# EAGLE design spectral_analyzer (EAGLE 5.06)
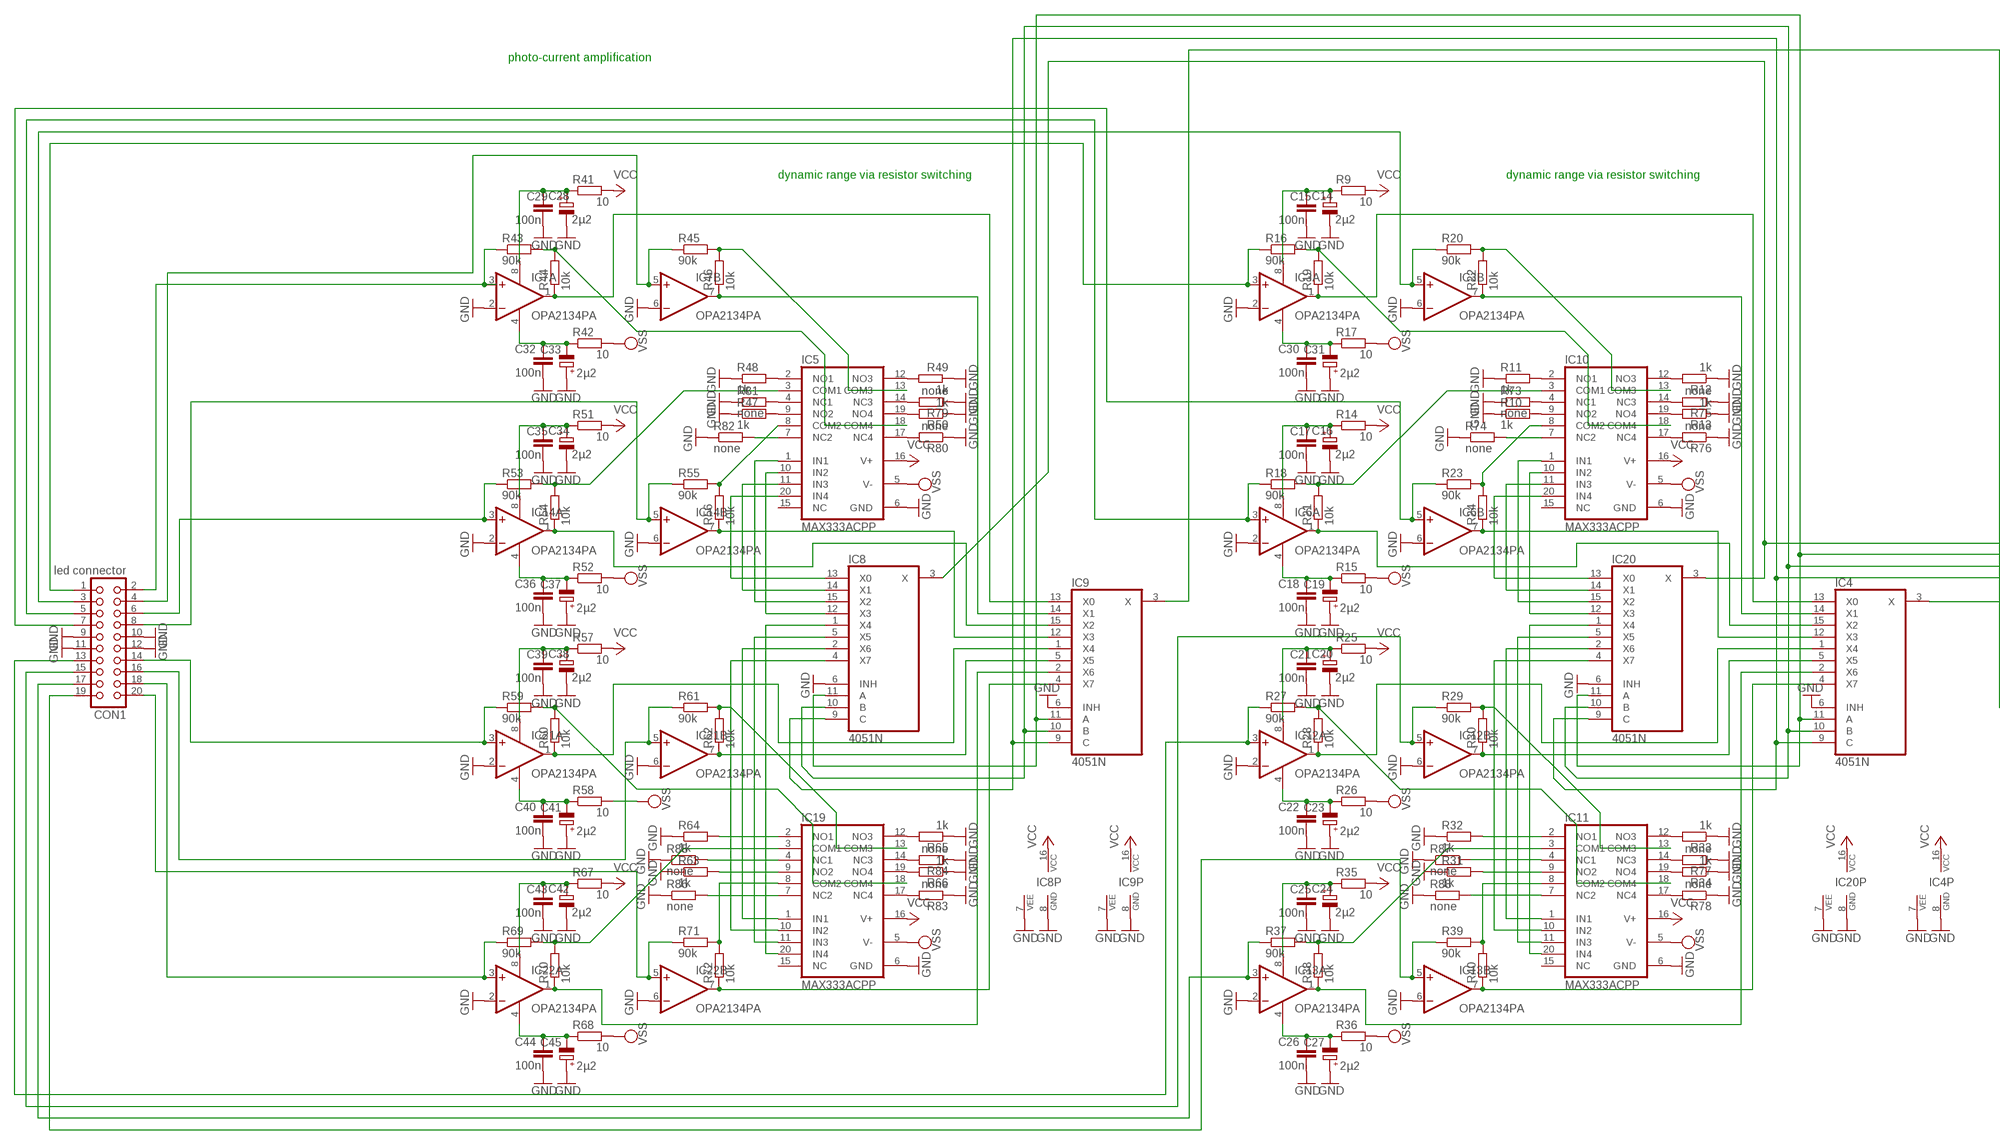
[diagram p0: schematic, sheet 1, part 1 of 2]
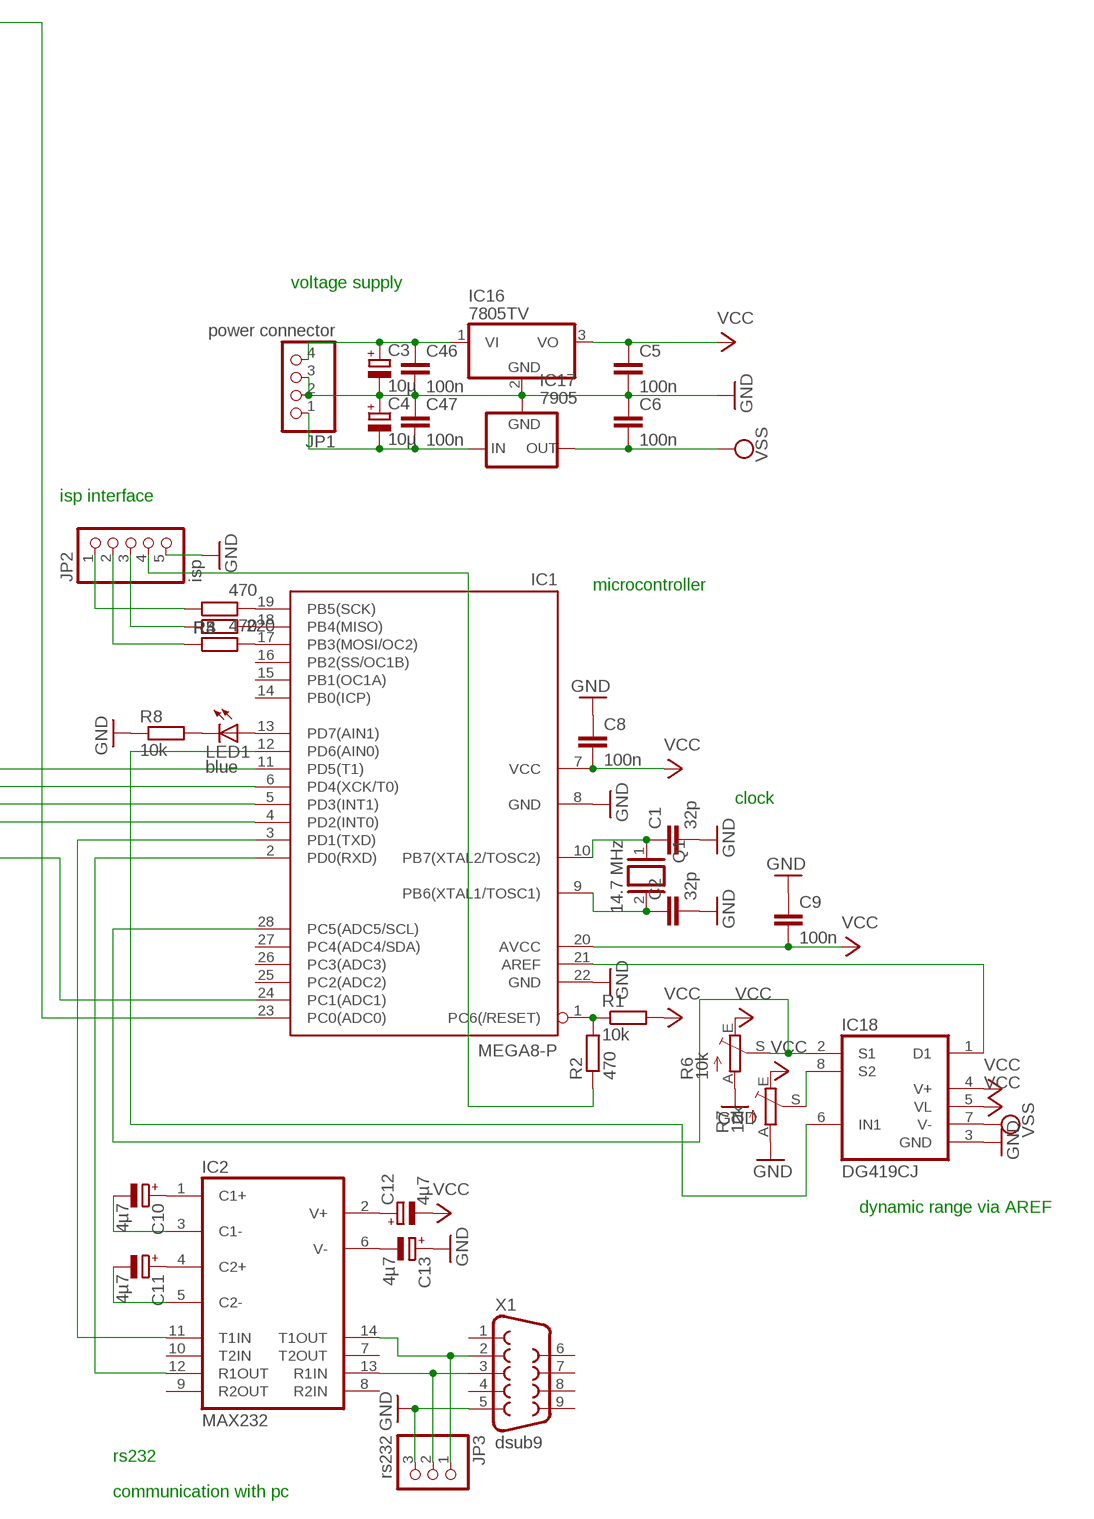
[diagram p1: schematic, sheet 1, part 2 of 2]

## Parts
C1  32p  C-EU025-025X050  [C025-025X050]
C2  32p  C-EU025-025X050  [C025-025X050]
C3  10µ  CPOL-EUE2,5-6E  [E2,5-6E]
C4  10µ  CPOL-EUE2,5-6E  [E2,5-6E]
C5  100n  C-EU025-025X050  [C025-025X050]
C6  100n  C-EU025-025X050  [C025-025X050]
C8  100n  C-EU025-025X050  [C025-025X050]
C9  100n  C-EU025-025X050  [C025-025X050]
C10  4µ7  CPOL-EUE2,5-6E  [E2,5-6E]
C11  4µ7  CPOL-EUE2,5-6E  [E2,5-6E]
C12  4µ7  CPOL-EUE2,5-6E  [E2,5-6E]
C13  4µ7  CPOL-EUE2,5-6E  [E2,5-6E]
C14  2µ2  CPOL-EUE2,5-6E  [E2,5-6E]
C15  100n  C-EU025-025X050  [C025-025X050]
C16  2µ2  CPOL-EUE2,5-6E  [E2,5-6E]
C17  100n  C-EU025-025X050  [C025-025X050]
C18  100n  C-EU025-025X050  [C025-025X050]
C19  2µ2  CPOL-EUE2,5-6E  [E2,5-6E]
C20  2µ2  CPOL-EUE2,5-6E  [E2,5-6E]
C21  100n  C-EU025-025X050  [C025-025X050]
C22  100n  C-EU025-025X050  [C025-025X050]
C23  2µ2  CPOL-EUE2,5-6E  [E2,5-6E]
C24  2µ2  CPOL-EUE2,5-6E  [E2,5-6E]
C25  100n  C-EU025-025X050  [C025-025X050]
C26  100n  C-EU025-025X050  [C025-025X050]
C27  2µ2  CPOL-EUE2,5-6E  [E2,5-6E]
C28  2µ2  CPOL-EUE2,5-6E  [E2,5-6E]
C29  100n  C-EU025-025X050  [C025-025X050]
C30  100n  C-EU025-025X050  [C025-025X050]
C31  2µ2  CPOL-EUE2,5-6E  [E2,5-6E]
C32  100n  C-EU025-025X050  [C025-025X050]
C33  2µ2  CPOL-EUE2,5-6E  [E2,5-6E]
C34  2µ2  CPOL-EUE2,5-6E  [E2,5-6E]
C35  100n  C-EU025-025X050  [C025-025X050]
C36  100n  C-EU025-025X050  [C025-025X050]
C37  2µ2  CPOL-EUE2,5-6E  [E2,5-6E]
C38  2µ2  CPOL-EUE2,5-6E  [E2,5-6E]
C39  100n  C-EU025-025X050  [C025-025X050]
C40  100n  C-EU025-025X050  [C025-025X050]
C41  2µ2  CPOL-EUE2,5-6E  [E2,5-6E]
C42  2µ2  CPOL-EUE2,5-6E  [E2,5-6E]
C43  100n  C-EU025-025X050  [C025-025X050]
C44  100n  C-EU025-025X050  [C025-025X050]
C45  2µ2  CPOL-EUE2,5-6E  [E2,5-6E]
C46  100n  C-EU025-025X050  [C025-025X050]
C47  100n  C-EU025-025X050  [C025-025X050]
CON1  led connector  CON20  [CON20]
IC1  MEGA8-P  [DIL28-3]
IC2  MAX232  [DIL16]
IC3  OPA2134PA  [DIL08]
IC4  4051N  [DIL16]
IC5  MAX333ACPP  [DIL20]
IC6  OPA2134PA  [DIL08]
IC7  OPA2134PA  [DIL08]
IC8  4051N  [DIL16]
IC9  4051N  [DIL16]
IC10  MAX333ACPP  [DIL20]
IC11  MAX333ACPP  [DIL20]
IC12  OPA2134PA  [DIL08]
IC13  OPA2134PA  [DIL08]
IC14  OPA2134PA  [DIL08]
IC16  7805TV  [TO220V]
IC17  7905  79XXS  [79XXS]
IC18  DG419CJ  [DIL08]
IC19  MAX333ACPP  [DIL20]
IC20  4051N  [DIL16]
IC21  OPA2134PA  [DIL08]
IC22  OPA2134PA  [DIL08]
JP1  power connector  PINHD-1X4  [1X04]
JP2  isp  PINHD-1X5  [1X05]
JP3  rs232  PINHD-1X3  [1X03]
LED1  blue  LED3MM  [LED3MM]
Q1  14.7 MHz  XTAL/S  [QS]
R1  10k  R-EU_0207/2V  [0207/2V]
R2  470  R-EU_0207/2V  [0207/2V]
R3  470  R-EU_0207/2V  [0207/2V]
R4  220  R-EU_0207/2V  [0207/2V]
R5  470  R-EU_0207/2V  [0207/2V]
R6  10k  TRIM_EU-ST10  [ST10]
R7  10k  TRIM_EU-ST10  [ST10]
R8  10k  R-EU_0207/2V  [0207/2V]
R9  10  R-EU_0207/2V  [0207/2V]
R10  1k  R-EU_0207/2V  [0207/2V]
R11  1k  R-EU_0207/2V  [0207/2V]
R12  1k  R-EU_0207/2V  [0207/2V]
R13  1k  R-EU_0207/2V  [0207/2V]
R14  10  R-EU_0207/2V  [0207/2V]
R15  10  R-EU_0207/2V  [0207/2V]
R16  90k  R-EU_0207/2V  [0207/2V]
R17  10  R-EU_0207/2V  [0207/2V]
R18  90k  R-EU_0207/2V  [0207/2V]
R19  10k  R-EU_0207/2V  [0207/2V]
R20  90k  R-EU_0207/2V  [0207/2V]
R21  10k  R-EU_0207/2V  [0207/2V]
R22  10k  R-EU_0207/2V  [0207/2V]
R23  90k  R-EU_0207/2V  [0207/2V]
R24  10k  R-EU_0207/2V  [0207/2V]
R25  10  R-EU_0207/2V  [0207/2V]
R26  10  R-EU_0207/2V  [0207/2V]
R27  90k  R-EU_0207/2V  [0207/2V]
R28  10k  R-EU_0207/2V  [0207/2V]
R29  90k  R-EU_0207/2V  [0207/2V]
R30  10k  R-EU_0207/2V  [0207/2V]
R31  1k  R-EU_0207/2V  [0207/2V]
R32  1k  R-EU_0207/2V  [0207/2V]
R33  1k  R-EU_0207/2V  [0207/2V]
R34  1k  R-EU_0207/2V  [0207/2V]
R35  10  R-EU_0207/2V  [0207/2V]
R36  10  R-EU_0207/2V  [0207/2V]
R37  90k  R-EU_0207/2V  [0207/2V]
R38  10k  R-EU_0207/2V  [0207/2V]
R39  90k  R-EU_0207/2V  [0207/2V]
R40  10k  R-EU_0207/2V  [0207/2V]
R41  10  R-EU_0207/2V  [0207/2V]
R42  10  R-EU_0207/2V  [0207/2V]
R43  90k  R-EU_0207/2V  [0207/2V]
R44  10k  R-EU_0207/2V  [0207/2V]
R45  90k  R-EU_0207/2V  [0207/2V]
R46  10k  R-EU_0207/2V  [0207/2V]
R47  1k  R-EU_0207/2V  [0207/2V]
R48  1k  R-EU_0207/2V  [0207/2V]
R49  1k  R-EU_0207/2V  [0207/2V]
R50  1k  R-EU_0207/2V  [0207/2V]
R51  10  R-EU_0207/2V  [0207/2V]
R52  10  R-EU_0207/2V  [0207/2V]
R53  90k  R-EU_0207/2V  [0207/2V]
R54  10k  R-EU_0207/2V  [0207/2V]
R55  90k  R-EU_0207/2V  [0207/2V]
R56  10k  R-EU_0207/2V  [0207/2V]
R57  10  R-EU_0207/2V  [0207/2V]
R58  10  R-EU_0207/2V  [0207/2V]
R59  90k  R-EU_0207/2V  [0207/2V]
R60  10k  R-EU_0207/2V  [0207/2V]
R61  90k  R-EU_0207/2V  [0207/2V]
R62  10k  R-EU_0207/2V  [0207/2V]
R63  1k  R-EU_0207/2V  [0207/2V]
R64  1k  R-EU_0207/2V  [0207/2V]
R65  1k  R-EU_0207/2V  [0207/2V]
R66  1k  R-EU_0207/2V  [0207/2V]
R67  10  R-EU_0207/2V  [0207/2V]
R68  10  R-EU_0207/2V  [0207/2V]
R69  90k  R-EU_0207/2V  [0207/2V]
R70  10k  R-EU_0207/2V  [0207/2V]
R71  90k  R-EU_0207/2V  [0207/2V]
R72  10k  R-EU_0207/2V  [0207/2V]
R73  none  R-EU_0207/2V  [0207/2V]
R74  none  R-EU_0207/2V  [0207/2V]
R75  none  R-EU_0207/2V  [0207/2V]
R76  none  R-EU_0207/2V  [0207/2V]
R77  none  R-EU_0207/2V  [0207/2V]
R78  none  R-EU_0207/2V  [0207/2V]
R79  none  R-EU_0207/2V  [0207/2V]
R80  none  R-EU_0207/2V  [0207/2V]
R81  none  R-EU_0207/2V  [0207/2V]
R82  none  R-EU_0207/2V  [0207/2V]
R83  none  R-EU_0207/2V  [0207/2V]
R84  none  R-EU_0207/2V  [0207/2V]
R85  none  R-EU_0207/2V  [0207/2V]
R86  none  R-EU_0207/2V  [0207/2V]
R87  none  R-EU_0207/2V  [0207/2V]
R88  none  R-EU_0207/2V  [0207/2V]
X1  dsub9  F09HP  [F09HP]

## Nets
GND: C1.2 C2.2 C3.- C4.+ C5.2 C6.1 C8.1 C9.1 C13.+ C14.- C15.2 C16.- C17.2 C18.2 C19.+ C20.- C21.2 C22.2 C23.+ C24.- C25.2 C26.2 C27.+ C28.- C29.2 C30.2 C31.+ C32.2 C33.+ C34.- C35.2 C36.2 C37.+ C38.- C39.2 C40.2 C41.+ C42.- C43.2 C44.2 C45.+ C46.2 C47.1 CON1.9 CON1.10 CON1.11 CON1.12 IC1.8(GND) IC1.22(GND) IC3.2(A:-IN) IC3.6(B:-IN) IC4.6(INH) IC4.7(VEE) IC4.8(GND) IC5.6(GND) IC6.2(A:-IN) IC6.6(B:-IN) IC7.2(A:-IN) IC7.6(B:-IN) IC8.6(INH) IC8.7(VEE) IC8.8(GND) IC9.6(INH) IC9.7(VEE) IC9.8(GND) IC10.6(GND) IC11.6(GND) IC12.2(A:-IN) IC12.6(B:-IN) IC13.2(A:-IN) IC13.6(B:-IN) IC14.2(A:-IN) IC14.6(B:-IN) IC16.2(GND) IC17.GND IC18.3(GND) IC19.6(GND) IC20.6(INH) IC20.7(VEE) IC20.8(GND) IC21.2(A:-IN) IC21.6(B:-IN) IC22.2(A:-IN) IC22.6(B:-IN) JP1.2 JP1.3 JP2.5 JP3.3 R6.A R7.A R8.1 R10.1 R11.1 R12.1 R13.1 R31.1 R32.1 R33.1 R34.1 R47.1 R48.1 R49.1 R50.1 R63.1 R64.1 R65.1 R66.1 R73.1 R74.1 R75.1 R76.1 R77.1 R78.1 R79.1 R80.1 R81.1 R82.1 R83.1 R84.1 R85.1 R86.1 R87.1 R88.1 X1.5
N$1: C1.1 IC1.10(PB7(XTAL2/TOSC2)) Q1.1
N$2: C2.1 IC1.9(PB6(XTAL1/TOSC1)) Q1.2
N$3: C4.- C47.2 IC17.IN JP1.1
N$4: C3.+ C46.1 IC16.1(VI) JP1.4
N$5: IC1.1(PC6(/RESET)) R1.1 R2.2
N$6: IC1.21(AREF) IC18.1(D1)
N$7: IC1.17(PB3(MOSI/OC2)) R3.2
N$8: IC1.18(PB4(MISO)) R4.2
N$9: IC1.19(PB5(SCK)) R5.2
N$10: IC18.8(S2) R7.S
N$11: JP2.4 R2.1
N$12: JP2.1 R5.1
N$13: JP2.2 R3.1
N$14: JP2.3 R4.1
N$15: IC1.28(PC5(ADC5/SCL)) IC18.2(S1) R6.S
N$16: LED1.K(C) R8.2
N$17: IC1.13(PD7(AIN1)) LED1.A
N$18: C10.+ IC2.1(C1+)
N$19: C11.+ IC2.4(C2+)
N$20: C12.+ IC2.2(V+)
N$21: C13.- IC2.6(V-)
N$22: C10.- IC2.3(C1-)
N$23: C11.- IC2.5(C2-)
N$24: IC2.13(R1IN) JP3.2 X1.3
N$25: IC2.14(T1OUT) JP3.1 X1.2
N$26: C14.+ C15.1 IC3.8(A:V+) R9.1
N$27: IC1.3(PD1(TXD)) IC2.11(T1IN)
N$28: IC19.8(COM2) R71.2 R72.2
N$29: IC3.7(B:OUT) IC4.14(X1) R22.1
N$30: IC10.9(NO2) R10.2
N$31: IC10.2(NO1) R11.2
N$32: IC10.12(NO3) R12.2
N$33: IC10.19(NO4) R13.2
N$34: C16.+ C17.1 IC6.8(A:V+) R14.1
N$35: CON1.1 IC3.3(A:+IN) R16.1
N$36: C30.1 C31.- IC3.4(A:V-) R17.1
N$37: C20.+ C21.1 IC12.8(A:V+) R25.1
N$38: IC3.1(A:OUT) IC4.13(X0) R19.1
N$39: C22.1 C23.- IC12.4(A:V-) R26.1
N$40: C18.1 C19.- IC6.4(A:V-) R15.1
N$41: CON1.3 IC3.5(B:+IN) R20.1
N$42: CON1.5 IC6.3(A:+IN) R18.1
N$43: IC10.3(COM1) R18.2 R21.2
N$44: IC4.1(X4) IC12.1(A:OUT) R28.1
N$45: IC10.8(COM2) R23.2 R24.2
N$46: CON1.7 IC6.5(B:+IN) R23.1
N$47: IC4.12(X3) IC6.7(B:OUT) R24.1
N$48: IC11.20(IN4) IC20.1(X4)
N$49: CON1.13 IC12.3(A:+IN) R27.1
N$50: IC10.13(COM3) R20.2 R22.2
N$51: IC10.20(IN4) IC20.13(X0)
N$52: CON1.15 IC12.5(B:+IN) R29.1
N$53: IC4.5(X5) IC12.7(B:OUT) R30.1
N$54: IC11.9(NO2) R31.2
N$55: IC11.2(NO1) R32.2
N$56: IC11.12(NO3) R33.2
N$57: IC11.19(NO4) R34.2
N$58: C24.+ C25.1 IC13.8(A:V+) R35.1
N$59: C26.1 C27.- IC13.4(A:V-) R36.1
N$60: CON1.17 IC13.3(A:+IN) R37.1
N$61: IC11.3(COM1) R37.2 R38.2
N$62: IC4.2(X6) IC13.1(A:OUT) R38.1
N$63: CON1.2 IC7.3(A:+IN) R43.1
N$64: CON1.19 IC13.5(B:+IN) R39.1
N$65: IC4.4(X7) IC13.7(B:OUT) R40.1
N$66: IC11.13(COM3) R29.2 R30.2
N$67: IC11.11(IN3) IC20.5(X5)
N$68: IC4.15(X2) IC6.1(A:OUT) R21.1
N$69: IC10.11(IN3) IC20.14(X1)
N$70: IC10.1(IN1) IC20.15(X2)
N$71: IC10.10(IN2) IC20.12(X3)
N$72: IC11.1(IN1) IC20.2(X6)
N$73: C28.+ C29.1 IC7.8(A:V+) R41.1
N$74: IC10.18(COM4) R16.2 R19.2
N$75: IC11.10(IN2) IC20.4(X7)
N$76: IC1.24(PC1(ADC1)) IC4.3(X)
N$77: IC11.18(COM4) R27.2 R28.2
N$78: IC1.23(PC0(ADC0)) IC9.3(X)
N$79: IC1.11(PD5(T1)) IC8.3(X) IC20.3(X)
N$80: C32.1 C33.- IC7.4(A:V-) R42.1
N$81: IC19.12(NO3) R65.2
N$82: IC7.1(A:OUT) IC9.13(X0) R44.1
N$83: CON1.4 IC7.5(B:+IN) R45.1
N$84: IC7.7(B:OUT) IC9.14(X1) R46.1
N$85: IC5.9(NO2) R47.2
N$86: IC5.2(NO1) R48.2
N$87: IC5.12(NO3) R49.2
N$88: IC5.19(NO4) R50.2
N$89: C34.+ C35.1 IC14.8(A:V+) R51.1
N$90: C36.1 C37.- IC14.4(A:V-) R52.1
N$91: CON1.6 IC14.3(A:+IN) R53.1
N$92: IC5.3(COM1) R53.2 R54.2
N$93: IC5.8(COM2) R55.2 R56.2
N$94: CON1.8 IC14.5(B:+IN) R55.1
N$95: IC9.12(X3) IC14.7(B:OUT) R56.1
N$96: IC5.13(COM3) R45.2 R46.2
N$97: C38.+ C39.1 IC21.8(A:V+) R57.1
N$98: C40.1 C41.- IC21.4(A:V-) R58.1
N$99: CON1.14 IC21.3(A:+IN) R59.1
N$100: CON1.16 IC21.5(B:+IN) R61.1
N$101: IC9.5(X5) IC21.7(B:OUT) R62.1
N$102: IC19.9(NO2) R63.2
N$103: IC19.2(NO1) R64.2
N$104: IC19.19(NO4) R66.2
N$105: IC19.17(NC4) R83.2
N$106: C42.+ C43.1 IC22.8(A:V+) R67.1
N$107: C44.1 C45.- IC22.4(A:V-) R68.1
N$108: CON1.18 IC22.3(A:+IN) R69.1
N$109: IC19.3(COM1) R69.2 R70.2
N$110: IC9.2(X6) IC22.1(A:OUT) R70.1
N$111: IC11.8(COM2) R39.2 R40.2
N$112: CON1.20 IC22.5(B:+IN) R71.1
N$113: IC9.4(X7) IC22.7(B:OUT) R72.1
N$114: IC19.13(COM3) R61.2 R62.2
N$115: IC9.15(X2) IC14.1(A:OUT) R54.1
N$116: IC9.1(X4) IC21.1(A:OUT) R60.1
N$117: IC5.20(IN4) IC8.13(X0)
N$118: IC5.11(IN3) IC8.14(X1)
N$119: IC5.1(IN1) IC8.15(X2)
N$120: IC5.10(IN2) IC8.12(X3)
N$121: IC5.18(COM4) R43.2 R44.2
N$122: IC8.1(X4) IC19.20(IN4)
N$123: IC8.5(X5) IC19.11(IN3)
N$124: IC8.2(X6) IC19.1(IN1)
N$125: IC8.4(X7) IC19.10(IN2)
N$126: IC1.6(PD4(XCK/T0)) IC4.11(A) IC8.11(A) IC9.11(A) IC20.11(A)
N$127: IC1.4(PD2(INT0)) IC4.9(C) IC8.9(C) IC9.9(C) IC20.9(C)
N$128: IC1.5(PD3(INT1)) IC4.10(B) IC8.10(B) IC9.10(B) IC20.10(B)
N$129: IC19.18(COM4) R59.2 R60.2
N$130: IC19.14(NC3) R84.2
N$131: IC1.12(PD6(AIN0)) IC18.6(IN1)
N$132: IC10.4(NC1) R73.2
N$133: IC10.7(NC2) R74.2
N$134: IC10.14(NC3) R75.2
N$135: IC10.17(NC4) R76.2
N$136: IC11.14(NC3) R77.2
N$137: IC11.17(NC4) R78.2
N$138: IC5.14(NC3) R79.2
N$139: IC5.17(NC4) R80.2
N$140: IC5.4(NC1) R81.2
N$141: IC5.7(NC2) R82.2
N$144: IC19.7(NC2) R86.2
N$145: IC19.4(NC1) R85.2
N$146: IC11.7(NC2) R88.2
N$147: IC11.4(NC1) R87.2
N$148: IC1.2(PD0(RXD)) IC2.12(R1OUT)
VCC: C5.1 C8.2 C9.2 C12.- IC1.7(VCC) IC1.20(AVCC) IC4.16(VCC) IC5.16(V+) IC8.16(VCC) IC9.16(VCC) IC10.16(V+) IC11.16(V+) IC16.3(VO) IC18.4(V+) IC18.5(VL) IC19.16(V+) IC20.16(VCC) R1.2 R6.E R7.E R9.2 R14.2 R25.2 R35.2 R41.2 R51.2 R57.2 R67.2
VSS: C6.2 IC5.5(V-) IC10.5(V-) IC11.5(V-) IC17.OUT IC18.7(V-) IC19.5(V-) R15.2 R17.2 R26.2 R36.2 R42.2 R52.2 R58.2 R68.2
Unconnected: IC1.14(PB0(ICP)) IC1.15(PB1(OC1A)) IC1.16(PB2(SS/OC1B)) IC1.25(PC2(ADC2)) IC1.26(PC3(ADC3)) IC1.27(PC4(ADC4/SDA)) IC2.7(T2OUT) IC2.8(R2IN) IC2.9(R2OUT) IC2.10(T2IN) IC5.15(NC) IC10.15(NC) IC11.15(NC) IC19.15(NC) X1.1 X1.4 X1.6 X1.7 X1.8 X1.9

## Notes on the sheet
- photo-current amplification
- dynamic range via resistor switching | dynamic range via resistor switching
- voltage supply
- isp interface
- microcontroller
- clock
- dynamic range via AREF
- rs232
- communication with pc

## Power pins joined to a net without a drawn wire
GND: IC2.15(GND)
VCC: IC2.16(VCC)

## Library data of the parts
C1 C2 C5 C6 C8 C9 C15 C17 C18 C21 C22 C25 C26 C29 C30 C32 C35 C36 C39 C40 C43 C44 C46 C47 = rcl:C-EU: CAPACITOR, European symbol
C3 C4 C10-C14 C16 C19 C20 C23 C24 C27 C28 C31 C33 C34 C37 C38 C41 C42 C45 = rcl:CPOL-EU: POLARIZED CAPACITOR, European symbol
CON1 = con-harting:CON20: CONNECTOR
IC1 = atmel:MEGA8-P: MICROCONTROLLER 8 Kbytes FLASH, 1 kbytes SRAM, 512 bytes EEPROM, USART, 4-channel 10 bit ADC, 2-channel 8 bit ADC Pin compatible with Atmega48, ATMega88, ATMega168 Source: avr.lbr
IC2 = maxim:MAX232: RS232 TRANSEIVER
IC3 IC6 IC7 IC12-IC14 IC21 IC22 = linear:OPA2*: Dual Operational Amplifier Low Power, Single-Supply, Rail-To-Rail Operational Amplifier Source: http://focus.ti.com/lit/ds/symlink/opa2345.pdf http://focus.ti.com .. opa241.pdf http://focus.ti.com/lit/ds/symlink/opa2134.pdf
IC4 IC8 IC9 IC20 = 40xx:4051: 8-channel ANALOG MULTIPLEXER
IC5 IC10 IC11 IC19 = maxim:MAX333ACPP: ANALOG SWITCH
IC16 = linear:78*: Positive VOLTAGE REGULATOR Source: http://cache.national.com/ds/LM/LM78L05.pdf http://www.fairchildsemi.com/ds/LM/LM7805.pdf
IC17 = v-reg:79XXS: VOLTAGE REGULATOR
IC18 = maxim:DG419CJ: ANALOG SWITCH
JP1 = pinhead:PINHD-1X4: PIN HEADER
JP2 = pinhead:PINHD-1X5: PIN HEADER
JP3 = pinhead:PINHD-1X3: PIN HEADER
LED1 = led:LED: LED OSRAM: - CHIPLED LG R971, LG N971, LY N971, LG Q971, LY Q971, LO R971, LY R971 LH N974, LH R974 LS Q976, LO Q976, LY Q976 LO Q996 - Hyper CHIPLED LW Q18S LB Q993, LB Q99A, LB R99A - SideLED LS A670, LO A670, LY A670, LG A670, LP A670 LB A673, LV A673, LT A673, LW A673 LH A674 LY A675 LS A676, LA A676, LO A676, LY A676, LW A676 LS A679, LY A679, LG A679 - Hyper Micro SIDELED® LS Y876, LA Y876, LO Y876, LY Y876 LT Y87S - SmartLED LW L88C, LW L88S LB L89C, LB L89S, LG L890 LS L89K, LO L89K, LY L89K LS L896, LA L896, LO L896, LY L896 - TOPLED LS T670, LO T670, LY T670, LG T670, LP T670 LSG T670, LSP T670, LSY T670, LOP T670, LYG T670 LG T671, LOG T671, LSG T671 LB T673, LV T673, LT T673, LW T673 LH T674 LS T676, LA T676, LO T676, LY T676, LB T676, LH T676, LSB T676, LW T676 LB T67C, LV T67C, LT T67C, LS T67K, LO T67K, LY T67K, LW E67C LS E67B, LA E67B, LO E67B, LY E67B, LB E67C, LV E67C, LT E67C LW T67C LS T679, LY T679, LG T679 LS T770, LO T770, LY T770, LG T770, LP T770 LB T773, LV T773, LT T773, LW T773 LH T774 LS E675, LA E675, LY E675, LS T675 LS T776, LA T776, LO T776, LY T776, LB T776 LHGB T686 LT T68C, LB T68C - Hyper Mini TOPLED® LB M676 - Mini TOPLED Santana® LG M470 LS M47K, LO M47K, LY M47K Source: http://www.osram.convergy.de LUXEON: - LUMILED® LXK2-PW12-R00, LXK2-PW12-S00, LXK2-PW14-U00, LXK2-PW14-V00 LXK2-PM12-R00, LXK2-PM12-S00, LXK2-PM14-U00 LXK2-PE12-Q00, LXK2-PE12-R00, LXK2-PE12-S00, LXK2-PE14-T00, LXK2-PE14-U00 LXK2-PB12-K00, LXK2-PB12-L00, LXK2-PB12-M00, LXK2-PB14-N00, LXK2-PB14-P00, LXK2-PB14-Q00 LXK2-PR12-L00, LXK2-PR12-M00, LXK2-PR14-Q00, LXK2-PR14-R00 LXK2-PD12-Q00, LXK2-PD12-R00, LXK2-PD12-S00 LXK2-PH12-R00, LXK2-PH12-S00 LXK2-PL12-P00, LXK2-PL12-Q00, LXK2-PL12-R00 Source: www.luxeon.com KINGBRIGHT: KA-3528ASYC Source: www.kingbright.com
Q1 = special:XTAL/S: CRYSTAL
R1-R5 R8-R72 = rcl:R-EU_: RESISTOR, European symbol
R6 R7 = pot:TRIM_EU-: POTENTIOMETER
R73-R88 = resistor:R-EU_: RESISTOR, European symbol
X1 = con-subd:F09: SUB-D

## Board
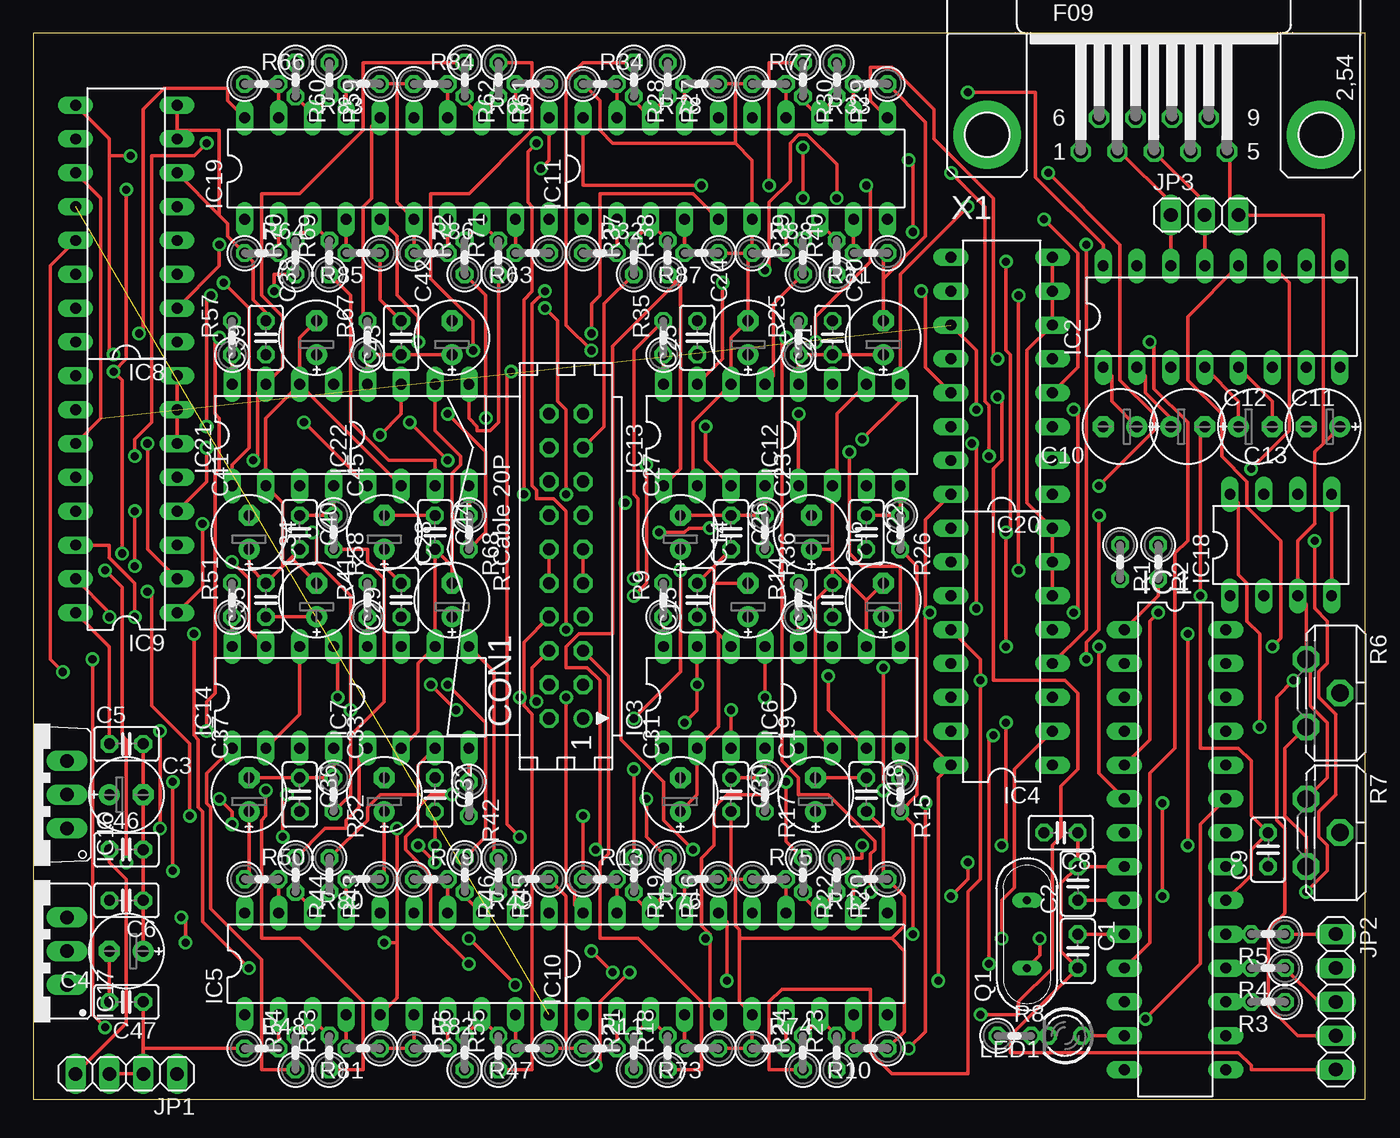
[diagram p2: board, top side]
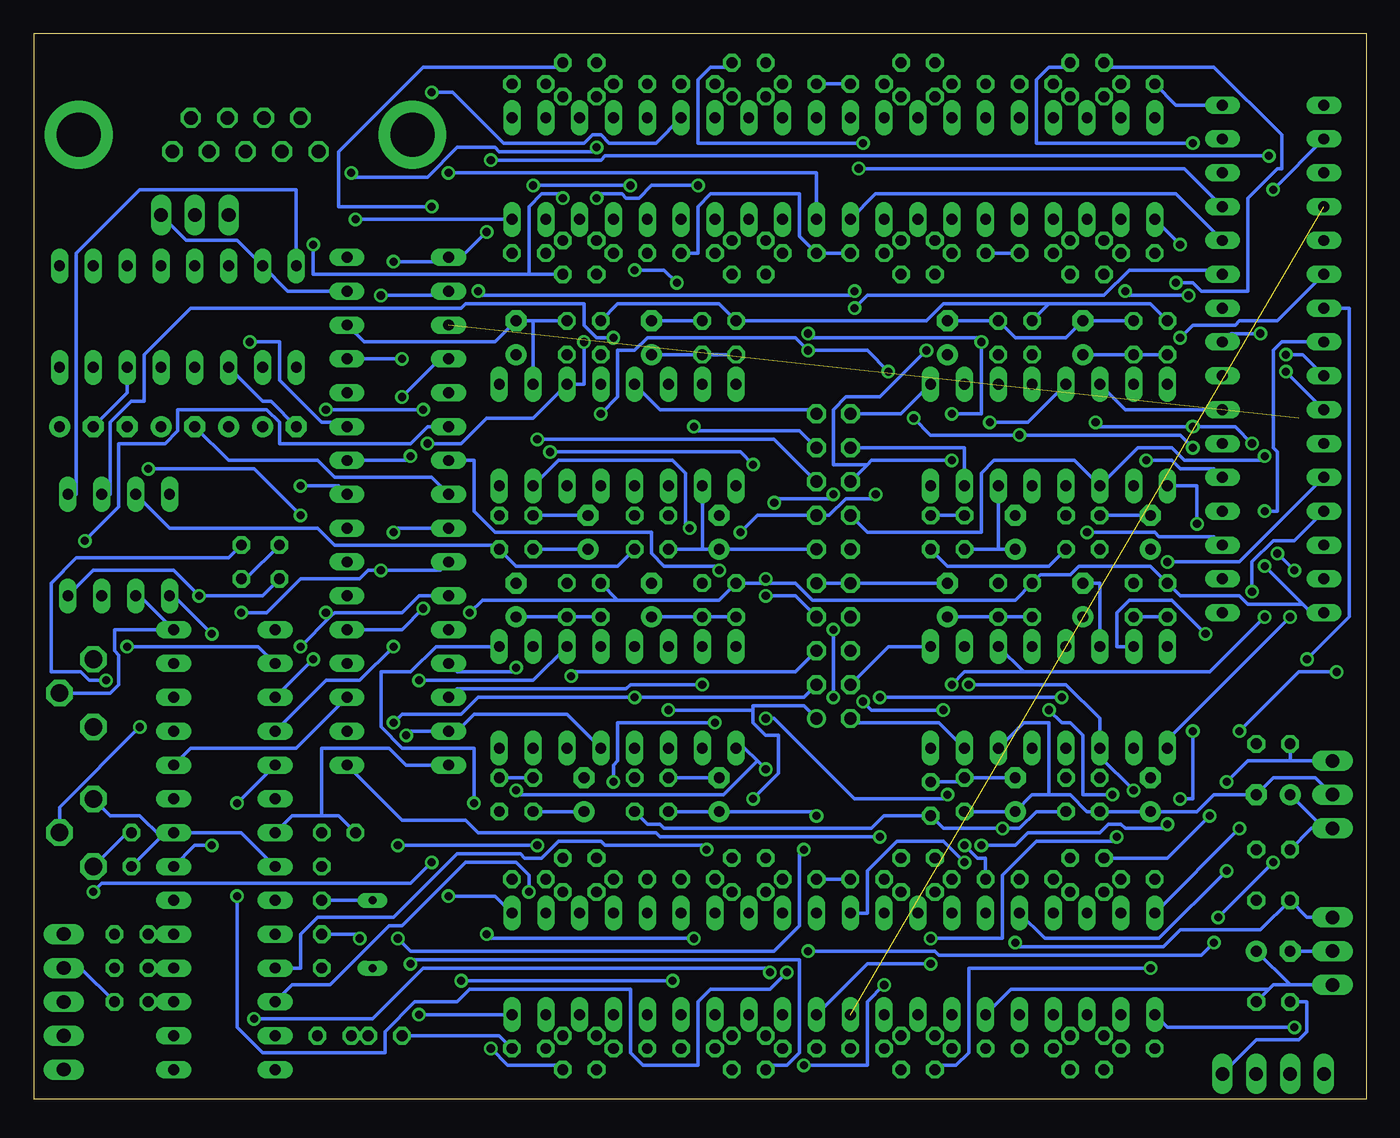
[diagram p3: board, bottom side, seen from below]

Size 100 x 80 mm. Coordinates in mm from the lower left corner, seen from the top.
Outline: 0,0 100,0 100,80 0,80 0,0
Copper layers (1*16): Top 0.035mm / dielectric 1.5mm / Bottom 0.035mm
Design rules "default": minimum track width 10mil, minimum drill 24mil, track to track 8mil, track to pad 8mil, pad to pad 8mil, via to via 8mil, smd to smd 8mil, copper to edge 40mil, drill to drill 8mil, minimum pad ring 10mil, minimum via ring 8mil, stop-mask expansion 4mil, vias tented up to drill 0mil, thermal gap 10mil

### Footprints (pad centres in the part's own frame; a part is rotated, then mirrored left to right if it is on the bottom)
C025-025X050 = drill 0.813 octagon: 1 -1.27,0; 2 1.27,0
E2,5-6E = drill 0.813 pad 1.575 round: + -1.27,0 | drill 0.813 pad 1.575 octagon: - 1.27,0
CON20 = drill 0.914 round: 1 -11.43,-1.27 | drill 0.914 octagon: 2 -11.43,1.27; 3 -8.89,-1.27; 4 -8.89,1.27; 5 -6.35,-1.27; 6 -6.35,1.27; 7 -3.81,-1.27; 8 -3.81,1.27; 9 -1.27,-1.27; 10 -1.27,1.27; 11 1.27,-1.27; 12 1.27,1.27; 13 3.81,-1.27; 14 3.81,1.27; 15 6.35,-1.27; 16 6.35,1.27; 17 8.89,-1.27; 18 8.89,1.27; 19 11.43,-1.27; 20 11.43,1.27
DIL28-3 = drill 0.813 long: 1 -16.51,-3.81; 2 -13.97,-3.81; 3 -11.43,-3.81; 4 -8.89,-3.81; 5 -6.35,-3.81; 6 -3.81,-3.81; 7 -1.27,-3.81; 8 1.27,-3.81; 9 3.81,-3.81; 10 6.35,-3.81; 11 8.89,-3.81; 12 11.43,-3.81; 13 13.97,-3.81; 14 16.51,-3.81; 15 16.51,3.81; 16 13.97,3.81; 17 11.43,3.81; 18 8.89,3.81; 19 6.35,3.81; 20 3.81,3.81; 21 1.27,3.81; 22 -1.27,3.81; 23 -3.81,3.81; 24 -6.35,3.81; 25 -8.89,3.81; 26 -11.43,3.81; 27 -13.97,3.81; 28 -16.51,3.81
DIL16 = drill 0.813 long: 1 -8.89,-3.81; 2 -6.35,-3.81; 3 -3.81,-3.81; 4 -1.27,-3.81; 5 1.27,-3.81; 6 3.81,-3.81; 7 6.35,-3.81; 8 8.89,-3.81; 9 8.89,3.81; 10 6.35,3.81; 11 3.81,3.81; 12 1.27,3.81; 13 -1.27,3.81; 14 -3.81,3.81; 15 -6.35,3.81; 16 -8.89,3.81
DIL08 = drill 0.813 long: 1 -3.81,-3.81; 2 -1.27,-3.81; 3 1.27,-3.81; 4 3.81,-3.81; 5 3.81,3.81; 6 1.27,3.81; 7 -1.27,3.81; 8 -3.81,3.81
DIL20 = drill 0.813 long: 1 -11.43,-3.81; 2 -8.89,-3.81; 3 -6.35,-3.81; 4 -3.81,-3.81; 5 -1.27,-3.81; 6 1.27,-3.81; 7 3.81,-3.81; 8 6.35,-3.81; 9 8.89,-3.81; 10 11.43,-3.81; 11 11.43,3.81; 12 8.89,3.81; 13 6.35,3.81; 14 3.81,3.81; 15 1.27,3.81; 16 -1.27,3.81; 17 -3.81,3.81; 18 -6.35,3.81; 19 -8.89,3.81; 20 -11.43,3.81
TO220V = drill 1.016 long: 1 -2.54,-2.54; 2 0,-2.54; 3 2.54,-2.54
79XXS = drill 1.016 long: GND -2.54,-2.54; IN 0,-2.54; OUT 2.54,-2.54
1X04 = drill 1.016 long: 1 -3.81,0; 2 -1.27,0; 3 1.27,0; 4 3.81,0
1X05 = drill 1.016 long: 1 -5.08,0; 2 -2.54,0; 3 0,0; 4 2.54,0; 5 5.08,0
1X03 = drill 1.016 long: 1 -2.54,0; 2 0,0; 3 2.54,0
LED3MM = drill 0.813 octagon: A -1.27,0; K 1.27,0
QS = drill 0.61 long: 1 -2.54,0; 2 2.54,0
0207/2V = drill 0.813 octagon: 1 -1.27,0; 2 1.27,0
ST10 = drill 1.321 octagon: A -2.54,-1.27; E 2.54,-1.27; S 0,1.27
F09HP = drill 1.016 octagon: 1 -5.486,-1.27; 2 -2.743,-1.27; 3 0,-1.27; 4 2.743,-1.27; 5 5.486,-1.27; 6 -4.115,1.27; 7 -1.372,1.27; 8 1.372,1.27; 9 4.115,1.27 | drill 3.302 pad 5.08 round: G1 -12.522,0; G2 12.522,0

### Placement (x,y rotation side)
C1  78.42,11.11 270 top
C2  78.42,16.19 90 top
C3  6.99,22.86 0 top
C4  6.99,11.11 180 top
C5  6.99,26.67 0 top
C6  6.99,14.92 180 top
C8  77.15,20 180 top
C9  92.71,18.73 90 top
C10  81.6,50.48 180 top
C11  91.76,50.48 0 top
C12  86.68,50.48 0 top
C13  96.84,50.48 180 top
C14  53.66,37.47 90 top
C15  49.85,37.47 90 top
C16  63.82,37.47 90 top
C17  60.01,37.47 90 top
C18  62.55,22.86 270 top
C19  58.74,22.86 90 top
C20  63.82,57.15 90 top
C21  60.01,57.15 90 top
C22  62.55,42.55 270 top
C23  58.42,42.55 90 top
C24  53.66,57.15 90 top
C25  49.85,57.15 90 top
C26  52.39,42.55 270 top
C27  48.58,42.55 90 top
C28  31.43,37.47 90 top
C29  27.62,37.47 90 top
C30  52.39,22.86 270 top
C31  48.58,22.86 90 top
C32  30.16,22.86 270 top
C33  26.35,22.86 90 top
C34  21.27,37.47 90 top
C35  17.46,37.47 90 top
C36  20,22.86 270 top
C37  16.19,22.86 90 top
C38  21.27,57.15 90 top
C39  17.46,57.15 90 top
C40  20,42.55 270 top
C41  16.19,42.55 90 top
C42  31.43,57.15 90 top
C43  27.62,57.15 90 top
C44  30.16,42.55 270 top
C45  26.35,42.55 90 top
C46  6.99,18.73 0 top
C47  6.99,7.3 180 top
CON1  40.01,40.01 90 top
IC1  85.72,18.73 270 top
IC2  89.22,58.74 0 top
IC3  51.12,30.16 0 top
IC4  72.71,33.97 90 top
IC5  27.3,10.16 0 top
IC6  61.28,30.16 0 top
IC7  28.89,30.16 0 top
IC8  6.99,65.72 90 top
IC9  6.99,45.4 90 top
IC10  52.7,10.16 0 top
IC11  52.7,69.85 0 top
IC12  61.28,49.85 0 top
IC13  51.12,49.85 0 top
IC14  18.73,30.16 0 top
IC16  0,22.86 90 top
IC17  0,11.11 90 top
IC18  93.66,41.59 0 top
IC19  27.3,69.85 0 top
IC20  72.71,54.29 90 top
IC21  18.73,49.85 0 top
IC22  28.89,49.85 0 top
JP1  6.99,1.91 180 top
JP2  97.79,7.3 270 top
JP3  87.95,66.36 0 top
LED1  77.47,4.76 180 top
Q1  74.61,12.38 90 top
R1  81.6,40.32 270 top
R2  84.45,40.32 270 top
R3  92.71,7.3 180 top
R4  92.71,9.84 180 top
R5  92.71,12.38 180 top
R6  96.84,30.48 270 top
R7  96.84,20 270 top
R8  73.66,4.76 0 top
R9  47.31,37.47 90 top
R10  62.87,3.81 180 top
R11  42.55,3.81 0 top
R12  62.87,16.51 180 top
R13  42.55,16.51 0 top
R14  57.47,37.47 90 top
R15  65.09,22.86 270 top
R16  47.62,16.83 270 top
R17  54.93,22.86 270 top
R18  47.62,3.49 90 top
R19  45.09,16.83 270 top
R20  60.33,16.83 270 top
R21  45.09,3.49 90 top
R22  57.78,16.83 270 top
R23  60.33,3.49 90 top
R24  57.78,3.49 90 top
R25  57.47,57.15 90 top
R26  65.09,42.55 270 top
R27  47.62,76.52 270 top
R28  45.09,76.52 270 top
R29  60.33,76.52 270 top
R30  57.78,76.52 270 top
R31  62.87,63.5 180 top
R32  42.55,63.5 0 top
R33  62.87,76.2 180 top
R34  42.55,76.2 0 top
R35  47.31,57.15 90 top
R36  54.93,42.55 270 top
R37  45.09,63.18 90 top
R38  47.62,63.18 90 top
R39  57.78,63.18 90 top
R40  60.33,63.18 90 top
R41  25.08,37.47 90 top
R42  32.7,22.54 270 top
R43  22.23,16.83 270 top
R44  19.68,16.83 270 top
R45  34.92,16.83 270 top
R46  32.38,16.83 270 top
R47  37.47,3.81 180 top
R48  17.14,3.81 0 top
R49  37.47,16.51 180 top
R50  17.14,16.51 0 top
R51  14.92,37.47 90 top
R52  22.54,22.86 270 top
R53  22.23,3.49 90 top
R54  19.68,3.49 90 top
R55  34.92,3.49 90 top
R56  32.38,3.49 90 top
R57  14.92,57.15 90 top
R58  22.54,42.55 270 top
R59  22.23,76.52 270 top
R60  19.68,76.52 270 top
R61  34.92,76.52 270 top
R62  32.38,76.52 270 top
R63  37.47,63.5 180 top
R64  17.14,63.5 0 top
R65  37.47,76.2 180 top
R66  17.14,76.2 0 top
R67  25.08,57.15 90 top
R68  32.7,42.55 270 top
R69  22.23,63.18 90 top
R70  19.68,63.18 90 top
R71  34.92,63.18 90 top
R72  32.38,63.18 90 top
R73  50.16,3.81 180 top
R74  55.24,3.81 0 top
R75  55.24,16.51 0 top
R76  50.16,16.51 180 top
R77  55.24,76.2 0 top
R78  50.16,76.2 180 top
R79  29.84,16.51 0 top
R80  24.77,16.51 180 top
R81  24.77,3.81 180 top
R82  29.84,3.81 0 top
R83  24.77,76.2 180 top
R84  29.84,76.2 0 top
R85  24.77,63.5 180 top
R86  29.84,63.5 0 top
R87  50.16,63.5 180 top
R88  55.24,63.5 0 top
X1  84.14,72.39 0 top

### Tracks (layer width: path | path; a pad name or v marks a point on that pad's centre or on a via)
GND  (via drill 0.61)
  Top 0.254: X1.5 89.85,71.12 89.85,66.99 JP3.3 96.84,66.36 96.84,49.21 | IC4.6 IC4.7 IC4.8 74.61,44.77 74.61,56.2 IC20.6 IC20.7 IC20.8 | 62.55,37.47 IC6.6 | 62.55,37.47 C16.- | IC6.2 58.74,27.62 58.74,37.47 C17.2 60.01,40.01 | 60.01,41.27 60.01,40.01 | 60.01,41.27 IC12.2 60.33,46.35 60.33,51.44 IC12.6 | 60.01,41.27 C23.+ | 60.01,40.01 62.55,37.47 | R31.1 63.82,63.18 63.82,61.59 | C20.- 63.82,61.59 | R33.1 66.99,73.34 66.99,64.77 63.82,61.59 | 73.34,4.76 C1.2 77.15,11.11 77.15,16.19 C2.2 | R8.1 73.34,4.76 | JP2.5 91.44,2.22 91.44,2.54 90.49,3.49 73.34,3.49 73.34,4.76 | 96.84,49.21 96.2,48.58 96.2,43.18 94.93,41.91 IC18.3 95.57,37.15 R6.A 95.89,32.7 95.89,29.53 97.16,28.26 97.16,24.13 R7.A | 96.84,49.21 C13.+ | C2.2 C8.1 | C2.2 IC1.8 | IC14.2 20,28.89 IC14.6 | IC9.6 IC9.7 IC9.8 | C41.+ 16.19,40.01 C35.2 18.73,40.01 | 18.73,40.01 19.37,40.64 | 19.37,40.64 C40.2 | 18.73,40.01 18.73,44.77 IC21.2 17.46,51.12 IC21.6 | 19.37,40.64 C34.- | 27.3,76.2 R84.1 | 27.3,76.2 R83.1 | R86.1 IC19.6 27.3,67.31 27.3,76.2 | C43.2 26.04,60.01 R85.1 | 10.79,72.71 IC8.8 | C39.2 17.46,59.05 16.51,60.01 16.51,62.87 R64.1 14.61,64.77 14.61,65.72 13.97,66.36 | 13.97,66.36 IC8.6 | 10.79,72.71 13.97,72.71 13.97,66.36 | 10.79,72.71 IC8.7 | IC21.6 20,57.15 C38.- | R80.1 26.35,16.83 C33.+ | C32.2 v30.16,19.05 | R50.1 16.19,16.83 C37.+ | C5.2 C3.- C46.2 C6.1 C4.+ | R81.1 R82.1 IC5.6 | 8.26,3.81 R48.1 | 8.26,3.81 JP1.2 JP1.3 | 8.26,3.81 C47.1 | 40.01,3.81 R11.1 | 40.01,3.81 R47.1 | 40.01,3.81 40.01,15.24 R49.1 | C18.2 63.82,20.32 63.82,16.83 R12.1 65.41,15.24 65.41,13.02 64.45,12.06 | R73.1 R74.1 IC10.6 53.02,7.3 53.02,12.06 | 52.7,16.51 R75.1 | 52.39,16.51 52.7,16.51 | 52.39,16.51 R76.1
  Top 0.254: C31.+ 49.85,22.86 IC3.2 51.44,27.94 51.44,34.92 | C30.2 52.39,16.51 | 53.02,12.06 53.02,12.7 52.7,13.02 52.7,16.51 | 53.02,12.06 64.45,12.06 | v41.27,21.27 R13.1 | 52.7,76.2 R77.1 | 52.7,76.2 R78.1 | R34.1 42.55,74.93 42.55,72.71 43.5,71.75 52.7,71.75 | 52.7,71.75 52.7,76.2 | 53.66,63.5 R87.1 | 53.66,63.5 C24.- 52.39,57.15 IC13.6 49.53,50.8 49.53,46.35 IC13.2 | 53.66,63.5 R88.1 IC11.6 53.98,70.48 52.7,71.75 | C26.2 51.12,40.01 | 51.12,40.01 C15.2 | 51.44,34.92 51.12,35.24 51.12,38.73 | 51.44,34.92 IC3.6 | 51.12,40.01 51.12,38.73 | 51.12,38.73 C14.- | IC7.2 28.89,27.62 28.89,32.7 IC7.6 C44.2 31.43,40.01 | C29.2 26.35,40.01 C45.+ | CON1.10 CON1.12 | CON1.9 CON1.11 | 31.43,40.01 C28.- | IC22.6 30.16,50.16 32.07,48.26 32.07,47.62 31.43,46.99 31.43,40.01 | IC22.2 IC21.6 | R10.1 65.41,5.08 65.41,11.11 64.45,12.06
  Bottom 0.254: IC20.7 80.96,60.64 IC2.15 84.77,64.45 88.58,64.45 JP3.3 | C23.+ C22.2 | 62.55,58.42 IC12.6 | 62.55,58.42 C20.- 65.41,56.83 75.25,56.83 IC20.6 | 62.55,58.42 C21.2 | R10.1 65.09,4.76 R8.1 | 90.49,19.68 90.17,20 IC1.22 | 90.49,19.68 C9.1 | R7.A 94.3,21.27 92.08,21.27 90.49,19.68 | IC1.22 90.49,19.68 | IC1.8 84.45,20 IC1.22 | IC9.7 18.1,51.75 IC21.6 | IC14.6 20,38.73 C34.- | C42.- C43.2 26.35,57.15 22.54,57.15 C38.- C39.2 | R85.1 R86.1 | R66.1 14.29,74.61 IC8.8 | R79.1 28.57,18.1 29.21,18.1 v30.16,19.05 | C32.2 C33.+ 25.08,22.86 23.81,22.86 | IC16.2 3.81,24.13 6.99,24.13 C3.- 11.43,22.86 12.7,21.59 C37.+ C36.2 20.95,21.59 22.23,22.86 23.81,22.86 | 5.71,8.57 6.99,8.57 7.3,8.26 | 5.71,8.57 IC17.GND | C47.1 7.3,8.26 | 5.71,8.57 C4.+ | IC5.6 26.67,8.26 7.3,8.26 | R13.1 R49.1 | C18.2 C19.+ | C30.2 C31.+ 41.59,21.59 v41.27,21.27 | R34.1 R65.1 | C24.- C25.2 | R63.1 R32.1 42.55,64.77 42.55,67.94 49.21,67.94 50.16,66.99 50.16,63.5 R87.1 | 49.85,41.27 IC13.2 | 49.85,41.27 C27.+ CON1.11 | 49.85,41.27 C26.2 | 27.62,41.27 IC22.2 | 27.62,41.27 C45.+ | CON1.9 CON1.10 C28.- | C44.2 27.62,41.27 | 23.81,22.86 23.81,28.26 25.72,28.26 IC7.2
N$1  (via drill 0.61)
  Top 0.254: Q1.1 75.56,10.79 v75.56,12.06 | C1.1 IC1.10
  Bottom 0.254: v75.56,12.06 75.88,12.38 C1.1
N$2
  Top 0.254: C2.1 IC1.9
  Bottom 0.254: Q1.2 C2.1
N$3
  Top 0.254: C47.2 C4.-
  Bottom 0.254: JP1.1 8.26,4.45 5.08,4.45 4.45,5.08 4.45,7.3 C47.2 | C4.- IC17.IN
N$4
  Top 0.254: JP1.4 6.99,5.71 6.99,16.51 5.71,17.78 C46.1
  Bottom 0.254: C46.1 4.13,20.32 3.17,20.32 | 3.17,20.32 C3.+ | 3.17,20.32 IC16.1
N$5
  Top 0.254: IC1.1 84.45,37.78 R2.2
  Bottom 0.254: R1.1 84.14,39.05 R2.2
N$6  (via drill 0.61)
  Top 0.254: v86.68,19.05 v86.68,34.92
  Bottom 0.254: IC1.21 87.95,19.05 v86.68,19.05 | v86.68,34.92 89.53,37.78 IC18.1
N$7
  Top 0.254: IC1.17 R3.2
N$8
  Top 0.254: IC1.18 R4.2
N$9
  Top 0.254: IC1.19 R5.2
N$10  (via drill 0.61)
  Top 0.254: IC18.8 90.49,44.77 90.49,39.37 91.12,38.73 91.12,35.88 92.08,34.92 v92.08,27.94
  Bottom 0.254: v92.08,27.94 98.11,21.91 R7.S
N$11  (via drill 0.61)
  Top 0.254: v94.61,31.43 93.34,30.16 93.34,20.95 93.98,20.32 93.98,13.97 92.71,12.7 92.71,6.99 94.93,4.76 JP2.4
  Bottom 0.254: R2.1 85.41,40.64 96.84,40.64 98.74,38.73 98.74,32.07 96.52,32.07 95.89,31.43 v94.61,31.43
N$12
  Top 0.254: R5.1 JP2.1
N$13
  Bottom 0.254: R3.1 96.52,9.84 JP2.2
N$14
  Top 0.254: R4.1 96.52,7.3 JP2.3
N$15
  Bottom 0.254: IC18.2 92.08,37.78 IC1.28 93.98,35.24 93.98,33.66 93.66,33.34 93.66,31.11 94.3,30.48 R6.S
N$16
  Top 0.254: R8.2 LED1.K
N$17
  Top 0.254: LED1.A IC1.13
N$18
  Top 0.254: IC2.1 80.96,54.29 80.96,52.39 C10.+
N$19
  Top 0.254: IC2.4 90.49,52.39 C11.+
N$20
  Top 0.254: IC2.2 83.5,54.29 83.5,53.02 85.41,51.12 C12.+
N$21
  Bottom 0.254: IC2.6 93.03,53.02 C13.-
N$22
  Bottom 0.254: IC2.3 82.87,52.39 82.23,52.39 C10.-
N$23
  Top 0.254: IC2.5 93.03,52.39 C11.-
N$24
  Top 0.254: IC2.13 JP3.2 87.95,67.31 X1.3
N$25
  Top 0.254: IC2.14 JP3.1 85.41,67.31 81.6,71.12 X1.2
N$26
  Top 0.254: IC3.8 R9.1
  Bottom 0.254: R9.1 C15.1 C14.+
N$27  (via drill 0.61)
  Top 0.254: v79.06,33.02 79.06,34.29 80.01,35.24 v80.01,43.81 | v91.44,47.31 94.3,50.16 94.3,61.28 IC2.11
  Bottom 0.254: IC1.3 v79.06,33.02 | v80.01,43.81 83.5,47.31 v91.44,47.31
N$28
  Top 0.254: R72.2 33.66,65.72 | 33.66,65.72 R71.2 | 33.66,65.72 IC19.8
N$29  (via drill 0.61)
  Top 0.254: R22.1 56.52,19.37 v56.52,23.81 | v48.9,28.26 49.85,29.21 v49.85,31.11 IC3.7
  Bottom 0.254: v56.52,23.81 56.52,25.08 56.2,25.4 56.2,28.26 v48.9,28.26 | IC4.14 68.26,30.8 55.56,30.8 55.24,31.11 v49.85,31.11
N$30
  Top 0.254: R10.2 IC10.9
N$31
  Top 0.254: R11.2 IC10.2
N$32
  Top 0.254: IC10.12 R12.2
N$33
  Top 0.254: IC10.19 R13.2
N$34
  Top 0.254: IC6.8 R14.1
  Bottom 0.254: R14.1 C17.1 C16.+
N$35  (via drill 0.61)
  Top 0.254: R16.1 46.04,19.68 v46.04,22.54 | v52.39,29.21 IC3.3
  Bottom 0.254: v46.04,22.54 44.13,24.45 44.13,27.3 45.09,27.3 46.04,28.26 46.04,29.21 | 46.04,29.21 46.04,29.53 42.23,29.53 CON1.1 | 46.04,29.21 v52.39,29.21
N$36
  Top 0.254: C30.1 R17.1 IC3.4
  Bottom 0.254: C31.- C30.1
N$37
  Top 0.254: IC12.8 R25.1 C21.1 C20.+
N$38  (via drill 0.61)
  Top 0.254: R19.1 v45.09,24.77 | v63.82,23.18 v63.82,32.38
  Bottom 0.254: 45.72,25.4 46.67,26.35 IC3.1 | v45.09,24.77 45.72,25.4 | IC4.13 68.26,32.07 64.14,32.07 v63.82,32.38 | v63.82,23.18 63.5,22.86 48.26,22.86 45.72,25.4
N$39
  Top 0.254: C22.1 R26.1 IC12.4
  Bottom 0.254: C23.- C22.1
N$40
  Top 0.254: R15.1 IC6.4 | C19.- C18.1
  Bottom 0.254: C18.1 R15.1
N$41  (via drill 0.61)
  Top 0.254: R20.1 62.23,18.1 v62.23,19.05 | v72.71,19.05 73.03,19.37 v73.03,28.26 | v54.93,30.16 IC3.5
  Bottom 0.254: v72.71,19.05 v62.23,19.05 | v73.03,28.26 72.39,28.89 67.94,28.89 66.67,30.16 v54.93,30.16 42.23,30.16 CON1.3
N$42  (via drill 0.61)
  Top 0.254: R18.1 50.16,2.22 50.16,7.3 45.4,12.06 42.55,12.06 42.55,17.78 43.18,18.41 43.18,31.75 CON1.5 | IC6.3 59.69,29.21 v59.69,31.75
  Bottom 0.254: v59.69,31.75 59.37,32.07 42.86,32.07 CON1.5
N$43
  Top 0.254: R21.2 46.35,6.03 | 46.35,6.03 R18.2 | 46.35,6.03 IC10.3
N$44  (via drill 0.61)
  Top 0.254: v57.47,51.44 IC12.1 | v41.91,56.2 40.01,58.1 40.01,76.52 41.27,77.79 R28.1 | v36.51,19.68 35.56,20.64 35.56,54.29 v35.88,54.61
  Bottom 0.254: v57.47,51.44 56.2,52.7 56.2,56.2 54.93,56.2 53.98,57.15 42.86,57.15 v41.91,56.2 37.47,56.2 v35.88,54.61 | IC4.1 72.39,20.95 67.63,20.95 66.67,20 53.34,20 53.02,19.68 v36.51,19.68
N$45
  Top 0.254: R24.2 59.05,6.03 | 59.05,6.03 R23.2 | 59.05,6.03 IC10.8
N$46  (via drill 0.61)
  Top 0.254: v65.72,3.81 66.99,5.08 v66.99,22.23 | v45.09,37.78 46.04,38.73 v46.04,47.62 | v61.28,48.58 61.28,40.96 62.23,40.01 65.09,40.01 IC6.5
  Bottom 0.254: R23.1 60.64,2.54 64.45,2.54 v65.72,3.81 | v66.99,22.23 66.99,26.35 72.39,26.35 73.98,27.94 73.98,32.07 71.75,32.07 69.85,33.97 IC6.5 | CON1.7 42.86,37.78 v45.09,37.78 | v46.04,47.62 46.99,48.58 v61.28,48.58
N$47  (via drill 0.61)
  Top 0.254: R24.1 55.24,2.22 55.24,7.3 56.2,8.26 62.87,8.26 62.87,3.49 64.45,1.91 70.17,1.91 70.17,15.56 71.12,16.51 v71.12,31.43 71.12,33.02 IC4.12
  Bottom 0.254: IC6.7 62.55,31.43 v71.12,31.43
N$48  (via drill 0.61)
  Top 0.254: v80.01,46.04 84.14,50.16 84.14,51.44 81.6,53.98 81.6,64.14 v76.2,69.53 | v57.78,67.63 v57.78,71.44 | v50.16,68.58 41.27,68.58 IC11.20
  Bottom 0.254: IC20.1 77.15,46.04 v80.01,46.04 | v76.2,69.53 75.88,69.22 70.48,69.22 68.26,71.44 65.41,71.44 65.09,71.12 58.1,71.12 v57.78,71.44 | v57.78,67.63 57.47,67.94 55.88,67.94 55.56,67.63 54.61,67.63 53.66,68.58 v50.16,68.58
N$49  (via drill 0.61)
  Top 0.254: v50.8,42.86 49.21,42.86 48.9,42.55 v46.99,42.55 | v37.78,71.75 37.15,71.12 37.15,67.31 37.47,66.99 37.47,60.64 36.83,60.01 v36.83,45.4
  Bottom 0.254: IC12.3 60.64,47.94 52.07,47.94 51.12,46.99 51.12,42.86 v50.8,42.86 | v46.99,42.55 45.72,43.81 CON1.13 40.32,43.81 39.05,45.09 37.15,45.09 v36.83,45.4 | R27.1 47.94,77.47 49.21,77.47 50.16,76.52 50.16,71.75 v37.78,71.75
N$50
  Top 0.254: R22.2 57.78,15.24 IC10.13 59.05,14.29 R20.2
N$51  (via drill 0.61)
  Top 0.254: IC10.20 40.64,14.61 40.64,15.56 40.01,16.19 v40.01,30.16 | v40.01,35.24 40.01,44.13 39.05,45.09 37.78,45.09 37.78,45.72 37.47,46.04 37.47,59.69 v38.42,60.64 | v66.67,60.64 66.99,60.33 66.99,54.93 IC20.13
  Bottom 0.254: v40.01,30.16 v40.01,35.24 | v38.42,60.64 38.73,60.33 66.36,60.33 v66.67,60.64
N$52  (via drill 0.61)
  Top 0.254: v70.17,66.99 65.09,61.91 IC12.5 65.09,52.39 v62.23,49.53
  Bottom 0.254: R29.1 60.64,77.47 70.8,77.47 77.15,71.12 77.15,66.99 v70.17,66.99 | CON1.15 44.45,49.53 v62.23,49.53
N$53  (via drill 0.61)
  Top 0.254: v70.48,49.21 70.8,48.9 v70.8,36.83 | R30.1 55.24,77.79 v55.24,68.58 | v62.55,68.58 62.87,68.26 62.87,62.87 58.74,58.74 v58.74,56.83
  Bottom 0.254: v70.48,49.21 67.94,49.21 66.04,51.12 62.55,51.12 IC12.7 58.74,53.66 v58.74,56.83 | v70.8,36.83 72.39,35.24 IC4.5 | v62.55,68.58 v55.24,68.58
N$54
  Top 0.254: R31.2 IC11.9
N$55
  Top 0.254: R32.2 IC11.2
N$56
  Top 0.254: IC11.12 R33.2
N$57
  Top 0.254: IC11.19 R34.2
N$58
  Top 0.254: IC13.8 R35.1
  Bottom 0.254: R35.1 C25.1 C24.+
N$59
  Top 0.254: IC13.4 R36.1 C26.1 C27.-
N$60  (via drill 0.61)
  Top 0.254: IC13.3 50.48,47.94 v50.48,50.48 | R37.1 42.86,59.69 42.86,50.48 CON1.17
  Bottom 0.254: v50.48,50.48 50.16,50.16 42.55,50.16 CON1.17
N$61
  Top 0.254: R37.2 46.35,65.72 | 46.35,65.72 R38.2 | 46.35,65.72 IC11.3
N$62  (via drill 0.61)
  Top 0.254: IC13.1 48.58,47.31 48.58,60.96 48.26,61.28 | 48.26,61.28 R38.1 | IC4.2 73.66,24.77 73.66,15.88 72.71,14.92 v72.71,12.06 | v42.23,18.73 42.55,19.05 42.55,31.43 41.59,32.38 40.01,32.38 40.01,33.97 40.96,34.92 43.5,34.92 43.5,56.52 48.26,61.28
  Bottom 0.254: v72.71,12.06 71.75,11.11 44.45,11.11 42.55,13.02 42.55,18.73 v42.23,18.73
N$63
  Top 0.254: R43.1 25.08,20.95 25.08,21.91 26.04,22.86 28.89,22.86 28.89,25.08 IC7.3
  Bottom 0.254: CON1.2 38.42,28.26 32.07,28.26 IC7.3
N$64
  Top 0.254: IC13.5 55.56,54.29 55.56,59.69 R39.1
  Bottom 0.254: CON1.19 41.59,51.75 53.02,51.75 IC13.5
N$65  (via drill 0.61)
  Top 0.254: IC4.4 79.06,35.24 v79.06,64.14 | IC13.7 51.75,55.56 v51.75,61.28 | v54.93,62.23 55.24,62.55 55.24,67.31 56.83,68.9 56.83,71.75 57.47,72.39 58.1,72.39 60.33,70.17 v60.33,67.63
  Bottom 0.254: v79.06,64.14 79.06,61.91 62.87,61.91 | 62.87,61.91 R40.1 | v51.75,61.28 52.7,62.23 v54.93,62.23 | v60.33,67.63 60.64,67.94 61.91,67.94 62.87,66.99 62.87,61.91
N$66
  Top 0.254: R30.2 57.78,74.93 IC11.13 59.05,73.98 R29.2
N$67  (via drill 0.61)
  Top 0.254: v72.39,55.56 72.07,55.88 72.07,67.63 67.63,72.07 67.63,74.3 64.45,77.47 62.87,77.47 62.87,74.93 IC11.11
  Bottom 0.254: v72.39,55.56 IC20.5
N$68  (via drill 0.61)
  Top 0.254: v71.75,10.16 71.75,26.99 v72.07,27.3
  Bottom 0.254: R21.1 44.77,2.54 43.5,2.54 42.55,3.49 42.55,10.48 71.44,10.48 v71.75,10.16 | v72.07,27.3 71.75,27.62 IC4.15 68.26,27.62 66.99,28.89 60.01,28.89 IC6.1
N$69  (via drill 0.61)
  Top 0.254: v68.9,15.24 70.17,16.51 v70.17,17.78 | v95.57,15.56 97.16,17.14 97.16,19.05 96.52,19.68 96.52,21.59 97.79,22.86 97.79,28.89 96.52,30.16 96.52,32.07 97.16,32.7 97.16,35.88 96.2,36.83 v96.2,41.91
  Bottom 0.254: IC10.11 65.41,15.24 v68.9,15.24 | v70.17,17.78 71.75,16.19 94.93,16.19 v95.57,15.56 | v96.2,41.91 93.66,44.45 93.66,49.21 90.17,49.21 89.22,50.16 89.22,51.75 82.55,51.75 81.6,50.8 81.6,49.21 71.75,49.21 70.48,50.48 IC20.14
N$70  (via drill 0.61)
  Top 0.254: v32.7,10.16 29.84,13.02 29.84,16.83 27.94,18.73 27.94,19.68 28.89,20.64 28.89,21.91 29.84,22.86 v31.43,22.86 | v45.09,28.57 48.58,32.07 v48.58,39.69
  Bottom 0.254: IC10.1 37.47,10.16 v32.7,10.16 | v31.43,22.86 31.75,22.54 38.42,22.54 44.45,28.57 v45.09,28.57 | v48.58,39.69 48.9,40.01 52.7,40.01 53.66,40.96 53.66,42.55 65.41,42.55 66.99,44.13 66.99,47.94 IC20.15
N$71  (via drill 0.61)
  Top 0.254: v71.12,6.35 73.98,6.35 73.98,7.3 76.52,9.84 76.52,19.05 77.15,19.68 77.15,23.5 78.42,24.77 78.42,30.48 77.47,31.43 72.07,31.43 72.07,47.31 72.71,47.94 72.71,52.39 v72.39,52.7
  Bottom 0.254: IC10.10 v71.12,6.35 | v72.39,52.7 69.53,55.56 IC20.12
N$72  (via drill 0.61)
  Top 0.254: v68.9,69.53 71.44,66.99 71.44,52.39 71.75,52.07 v71.75,48.26
  Bottom 0.254: IC11.1 41.27,69.53 v68.9,69.53 | v71.75,48.26 72.07,47.94 IC20.2
N$73
  Top 0.254: IC7.8 R41.1
  Bottom 0.254: R41.1 C29.1 C28.+
N$74
  Top 0.254: R19.2 45.09,15.24 IC10.18 46.35,14.29 R16.2
N$75  (via drill 0.61)
  Top 0.254: IC20.4 78.42,54.93 78.42,63.5 v75.88,66.04
  Bottom 0.254: v75.88,66.04 IC11.10
N$76
  Bottom 0.254: IC4.3 80.33,26.35 88.27,26.35 IC1.24
N$77
  Top 0.254: R28.2 45.09,74.93 IC11.18 46.35,73.98 R27.2
N$78  (via drill 0.61)
  Top 0.254: v20.95,42.55 21.27,42.23 21.27,40.32 23.81,37.78 v23.81,29.21 | v19.05,22.86 18.73,22.54 v18.73,19.68 | v32.7,12.06 v36.2,8.57 | v42.23,2.54 42.55,2.86 42.55,7.3 v44.77,9.53 | v83.5,6.03 87.63,10.16 87.63,20.64 IC1.23
  Bottom 0.254: IC9.3 11.43,42.23 15.56,42.23 15.88,42.55 v20.95,42.55 | v23.81,29.21 22.86,28.26 22.23,28.26 21.27,27.3 21.27,22.86 v19.05,22.86 | v18.73,19.68 19.05,19.37 24.77,19.37 27.3,16.83 27.3,12.06 v32.7,12.06 | v36.2,8.57 37.47,7.3 37.47,2.54 v42.23,2.54 | v44.77,9.53 45.09,9.84 70.8,9.84 74.61,6.03 v83.5,6.03
N$79  (via drill 0.61)
  Top 0.254: v83.82,56.83 84.14,56.52 84.14,53.34 86.68,50.8 86.68,41.91 85.72,40.96 85.72,26.35 83.82,24.45 83.82,11.75 IC1.11 | v38.42,59.37 39.37,58.42 39.37,52.39 40.01,51.75 v40.01,45.4 | v44.45,44.77 44.13,44.45 44.13,26.99 47.31,23.81 47.31,20.95 v49.53,18.73
  Bottom 0.254: IC20.3 76.83,50.8 78.42,50.8 81.6,53.98 81.6,56.83 v83.82,56.83 | IC8.3 11.11,62.23 17.78,62.23 19.68,60.33 37.47,60.33 v38.42,59.37 | v40.01,45.4 40.32,45.09 44.13,45.09 v44.45,44.77 | v49.53,18.73 49.85,19.05 57.15,19.05 57.47,19.37 60.64,19.37 61.91,18.1 63.18,18.1 63.5,18.41 68.26,18.41 73.03,13.65 78.74,13.65 80.01,12.38 80.01,9.84 IC1.11
N$80
  Top 0.254: R42.1 IC7.4
  Bottom 0.254: R42.1 30.48,23.81 C32.1 C33.-
N$81
  Top 0.254: IC19.12 R65.2
N$82  (via drill 0.61)
  Top 0.254: R44.1 21.91,20.32 23.5,20.32 23.5,20.95 24.45,21.91 24.45,25.72 IC7.1 | v8.57,38.1 8.89,37.78 8.89,29.53 11.75,26.67 v11.75,21.27
  Bottom 0.254: IC9.13 5.4,41.91 6.99,41.91 8.57,40.32 v8.57,38.1 | v11.75,21.27 14.92,18.1 R44.1
N$83
  Top 0.254: R45.1 34.61,18.41 34.61,32.07 IC7.5
  Bottom 0.254: CON1.4 35.88,33.97 IC7.5
N$84  (via drill 0.61)
  Top 0.254: IC9.14 5.71,41.59 5.71,40.64 7.62,38.73 v7.62,36.2 | R46.1 33.97,19.68 33.97,28.26 v31.11,31.11
  Bottom 0.254: v7.62,36.2 11.75,32.07 25.72,32.07 | 25.72,32.07 IC7.7 | v31.11,31.11 30.16,32.07 25.72,32.07
N$85
  Top 0.254: R47.2 IC5.9
N$86
  Top 0.254: R48.2 IC5.2
N$87
  Top 0.254: IC5.12 R49.2
N$88
  Top 0.254: IC5.19 R50.2
N$89
  Top 0.254: IC14.8 R51.1 | C35.1 C34.+
  Bottom 0.254: R51.1 C35.1
N$90
  Top 0.254: IC14.4 R52.1 C36.1 C37.-
N$91  (via drill 0.61)
  Top 0.254: R53.1 24.77,2.22 24.77,7.3 20,12.06 17.14,12.06 17.14,20.95 17.46,21.27 v17.46,23.18 | CON1.6 37.47,32.38 37.47,30.16 v37.78,29.84 | v29.84,31.11 v31.75,29.21
  Bottom 0.254: v17.46,23.18 20,25.72 IC14.3 20,28.57 22.54,31.11 v29.84,31.11 | v37.78,29.84 37.15,29.21 v31.75,29.21
N$92
  Top 0.254: R54.2 20.95,6.03 | 20.95,6.03 R53.2 | 20.95,6.03 IC5.3
N$93
  Top 0.254: R56.2 33.66,6.03 | 33.66,6.03 R55.2 | 33.66,6.03 IC5.8
N$94  (via drill 0.61)
  Top 0.254: R55.1 37.47,2.22 37.47,28.89 36.83,29.53 36.83,30.16 | 36.83,30.16 36.83,34.29 CON1.8 | IC14.5 22.86,33.66 v22.86,30.16 | 36.83,30.16 v36.51,30.16
  Bottom 0.254: v36.51,30.16 v22.86,30.16
N$95  (via drill 0.61)
  Top 0.254: v16.19,9.84 12.7,13.34 12.7,21.59 12.38,21.91 12.38,26.99 12.06,27.3 v12.06,34.92 | v14.92,40.32 16.19,39.05 16.19,35.24 IC14.7
  Bottom 0.254: R56.1 32.07,2.54 30.8,2.54 29.84,3.49 29.84,9.84 v16.19,9.84 | v12.06,34.92 14.61,37.47 17.78,37.47 18.73,36.51 18.73,33.97 IC14.7 | IC9.12 9.53,40.32 v14.92,40.32
N$96
  Top 0.254: R46.2 32.38,15.24 IC5.13 33.66,14.29 R45.2
N$97
  Top 0.254: IC21.8 R57.1
  Bottom 0.254: R57.1 C39.1 C38.+
N$98
  Top 0.254: C40.1 R58.1 IC21.4
  Bottom 0.254: C41.- C40.1
N$99  (via drill 0.61)
  Top 0.254: v13.02,71.75 12.06,70.8 8.89,70.8 8.89,50.8 7.62,49.53 v7.62,48.26
  Bottom 0.254: CON1.14 37.47,42.55 28.89,42.55 28.89,46.99 27.94,47.94 21.91,47.94 IC21.3 17.14,48.9 14.61,48.9 13.65,47.94 7.94,47.94 v7.62,48.26 | R59.1 22.54,77.47 23.81,77.47 24.77,76.52 24.77,71.75 v13.02,71.75
N$100  (via drill 0.61)
  Top 0.254: v28.26,50.8 v31.11,47.94 | R61.1 37.47,77.79 37.47,72.71 32.7,67.94 29.84,67.94 29.84,61.59 33.02,58.42 v33.02,56.2
  Bottom 0.254: IC21.5 25.4,50.8 v28.26,50.8 | v31.11,47.94 37.15,47.94 37.47,47.62 | 37.47,47.62 CON1.16 | v33.02,56.2 36.51,52.7 39.05,52.7 40.01,51.75 40.01,47.62 37.47,47.62
N$101  (via drill 0.61)
  Top 0.254: v16.51,47.94 16.83,48.26 16.83,53.02 IC21.7 18.73,54.93 18.73,58.74 17.14,60.33 17.14,67.94 20,67.94 24.77,72.71 24.77,77.79 R62.1
  Bottom 0.254: IC9.5 11.43,47.31 13.97,47.31 14.61,47.94 v16.51,47.94
N$102
  Top 0.254: R63.2 IC19.9
N$103
  Top 0.254: R64.2 IC19.2
N$104
  Top 0.254: IC19.19 R66.2
N$105
  Top 0.254: IC19.17 R83.2
N$106
  Top 0.254: IC22.8 R67.1 C43.1 C42.+
N$107
  Top 0.254: R68.1 IC22.4 | C45.- C44.1
  Bottom 0.254: C44.1 R68.1
N$108
  Top 0.254: R69.1 23.81,60.33 23.81,50.8 26.67,47.94 30.16,47.94 IC22.3
  Bottom 0.254: IC22.3 30.16,48.9 CON1.18
N$109
  Top 0.254: R70.2 20.95,65.72 | 20.95,65.72 R69.2 | 20.95,65.72 IC19.3
N$110  (via drill 0.61)
  Top 0.254: IC9.2 8.57,41.27 v8.57,49.21 | v20.32,50.8 IC22.1 | R70.1 18.1,61.91 v18.1,60.64 | v13.34,60.33 13.02,60.01 v13.02,50.48
  Bottom 0.254: v8.57,49.21 9.84,50.48 v13.02,50.48 20,50.48 v20.32,50.8 | v18.1,60.64 17.78,60.33 v13.34,60.33
N$111
  Top 0.254: R39.2 59.05,65.72 | 59.05,65.72 R40.2 | 59.05,65.72 IC11.8
N$112
  Top 0.254: R71.1 34.92,50.8 34.29,50.16 33.34,50.16 33.34,50.48 32.7,51.12 IC22.5
  Bottom 0.254: IC22.5 34.92,51.44 CON1.20
N$113  (via drill 0.61)
  Top 0.254: IC9.4 13.02,46.35 v13.02,48.9 | v26.04,49.85 27.62,51.44 IC22.7 | R72.1 33.97,60.33 v33.97,51.12
  Bottom 0.254: v13.02,48.9 13.97,49.85 v26.04,49.85 32.7,49.85 v33.97,51.12
N$114
  Top 0.254: R62.2 32.38,74.93 IC19.13 33.66,73.98 R61.2
N$115  (via drill 0.61)
  Top 0.254: R54.1 17.14,2.22 17.14,10.48 13.34,14.29 13.34,21.91 13.02,22.23 13.02,24.45 IC14.1 | IC9.15 5.71,36.51 v5.71,36.2
  Bottom 0.254: v5.71,36.2 14.92,26.99 IC14.1
N$116  (via drill 0.61)
  Top 0.254: IC9.1 12.7,38.42 v12.7,43.18 | v14.29,61.28 16.19,59.37 16.19,48.9 14.92,47.62 IC21.1
  Bottom 0.254: v12.7,43.18 12.7,46.04 IC21.1 | R60.1 19.37,77.47 11.43,77.47 6.35,72.39 6.35,69.85 6.67,69.85 8.89,67.63 8.89,60.64 12.38,60.64 13.02,61.28 v14.29,61.28
N$117  (via drill 0.61)
  Top 0.254: v9.53,20.32 v9.53,27.62 | v2.22,32.07 1.27,33.02 1.27,62.55 IC8.13
  Bottom 0.254: IC5.20 v9.53,20.32 | v9.53,27.62 5.08,32.07 v2.22,32.07
N$118  (via drill 0.61)
  Top 0.254: v13.97,57.15 13.65,56.83 13.65,51.44 13.97,51.12 13.97,47.31 13.65,46.99 13.65,30.48 13.02,29.84 v13.02,27.62 | v13.97,22.54 14.92,21.59 v14.92,20.64 | v28.89,19.05 v30.16,17.78
  Bottom 0.254: IC8.14 6.67,58.42 9.53,58.42 9.84,58.1 13.02,58.1 v13.97,57.15 | v13.02,27.62 13.02,22.54 v13.97,22.54 | v14.92,20.64 15.24,20.32 18.1,20.32 18.41,20.64 19.37,20.64 20,20 25.4,20 26.35,19.05 v28.89,19.05 | v30.16,17.78 31.75,19.37 35.24,19.37 37.47,17.14 37.47,13.97 IC5.11
N$119  (via drill 0.61)
  Top 0.254: v5.4,5.4 4.45,6.35 v4.45,33.02
  Bottom 0.254: IC5.1 14.92,5.4 v5.4,5.4 | v4.45,33.02 1.27,36.2 1.27,59.37 IC8.15
N$120  (1 unrouted)
N$121
  Top 0.254: R44.2 20.95,14.29 | 20.95,14.29 R43.2 | 20.95,14.29 IC5.18
N$122  (via drill 0.61)
  Top 0.254: v7.94,57.47 8.26,57.78 8.26,74.3 9.84,75.88 14.61,75.88 14.61,74.93 IC19.20
  Bottom 0.254: IC8.1 10.16,57.47 v7.94,57.47
N$123  (via drill 0.61)
  Top 0.254: v38.1,69.85 38.73,70.48 IC19.11
  Bottom 0.254: IC8.5 13.65,69.85 v38.1,69.85
N$124  (via drill 0.61)
  Top 0.254: IC8.2 13.97,62.55 v13.97,64.14
  Bottom 0.254: v13.97,64.14 IC19.1
N$125
  Bottom 0.254: IC8.4 14.29,67.94 36.83,67.94 IC19.10
N$126  (via drill 0.61)  (1 unrouted)
  Top 0.254: IC9.11 5.08,51.12 5.08,67.63 IC8.11 | IC1.6 80.01,24.45 v80.01,33.97 | IC20.11 70.8,56.2 v70.8,51.75 | v78.11,51.75 78.42,51.44 78.42,36.83 v78.11,36.51
  Bottom 0.254: 77.79,36.2 77.47,36.51 72.39,36.51 71.12,37.78 IC4.11 | v80.01,33.97 77.79,36.2 | v78.11,51.75 v70.8,51.75 | 77.79,36.2 v78.11,36.51
N$127  (via drill 0.61)
  Top 0.254: v6.03,55.88 5.71,56.2 5.71,70.8 | 5.71,70.8 5.71,72.07 IC8.9 | v73.03,33.97 v73.03,42.55 73.34,42.86 73.34,55.88 73.03,56.2 v73.03,62.87 | 5.71,70.8 v7.3,70.8 | v65.72,70.48 66.04,70.17 v66.04,65.09
  Bottom 0.254: IC9.9 4.76,55.88 v6.03,55.88 | IC1.4 78.11,31.43 75.56,31.43 v73.03,33.97 | v73.03,42.55 72.71,42.86 IC4.9 | v73.03,62.87 69.22,62.87 IC20.9 67.94,63.18 v66.04,65.09 | v7.3,70.8 57.15,70.8 57.47,70.48 v65.72,70.48
N$128  (via drill 0.61)
  Top 0.254: v6.99,68.26 6.99,55.56 v6.03,54.61 6.67,53.98 v6.67,40.96 | v84.45,36.51 83.82,35.88 83.82,26.99 IC1.5 | v73.98,39.69 v73.98,60.33 | v5.4,39.69 6.67,38.42 6.67,27.3 6.99,26.99 v6.99,17.78 | v11.11,13.65 11.43,13.34 v11.43,11.75 | v41.91,11.11 v43.5,9.53 | v84.77,15.24 v84.77,22.23
  Bottom 0.254: v6.03,54.61 IC9.10 | v6.99,68.26 IC8.10 | IC4.10 69.53,39.69 v73.98,39.69 74.93,39.69 75.56,39.05 80.01,39.05 82.55,36.51 v84.45,36.51 | IC20.10 69.22,60.33 v73.98,60.33 | v5.4,39.69 v6.67,40.96 | v11.11,13.65 v6.99,17.78 | v11.43,11.75 12.38,10.79 32.07,10.79 32.38,11.11 v41.91,11.11 | v43.5,9.53 44.77,8.26 49.21,8.26 50.16,7.3 50.16,2.54 54.29,2.54 55.24,3.49 55.24,8.26 67.31,8.26 68.26,7.3 71.44,7.3 73.66,5.08 73.66,3.49 82.87,3.49 84.77,5.4 v84.77,15.24 | v84.77,22.23 IC1.5
N$129
  Top 0.254: R60.2 20.95,73.98 | 20.95,73.98 R59.2 | 20.95,73.98 IC19.18
N$130
  Top 0.254: IC19.14 R84.2
N$131  (via drill 0.61)
  Top 0.254: v62.87,15.56 62.87,18.41 63.18,18.73 63.18,19.37 59.69,22.86 57.47,22.86 57.47,24.13 56.2,25.4 56.2,56.83 v56.52,57.15
  Bottom 0.254: IC1.12 80.64,8.57 77.79,8.57 73.34,13.02 72.39,13.02 67.63,17.78 63.82,17.78 62.87,16.83 v62.87,15.56 | v56.52,57.15 57.78,57.15 58.74,58.1 58.74,59.69 67.63,59.69 67.94,59.37 88.27,59.37 91.76,55.88 91.76,52.39 92.71,52.39 94.3,50.8 94.3,45.4 IC18.6
N$132
  Top 0.254: R73.2 IC10.4
N$133
  Top 0.254: R74.2 IC10.7
N$134
  Top 0.254: IC10.14 R75.2
N$135
  Top 0.254: IC10.17 R76.2
N$136
  Top 0.254: IC11.14 R77.2
N$137
  Top 0.254: IC11.17 R78.2
N$138
  Top 0.254: IC5.14 R79.2
N$139
  Top 0.254: IC5.17 R80.2
N$140
  Top 0.254: R81.2 IC5.4
N$141
  Top 0.254: R82.2 IC5.7
N$144
  Top 0.254: R86.2 IC19.7
N$145
  Top 0.254: R85.2 IC19.4
N$146
  Top 0.254: R88.2 IC11.7
N$147
  Top 0.254: R87.2 IC11.4
N$148  (via drill 0.61)
  Top 0.254: v93.03,33.97 93.66,34.61 93.66,41.91 91.12,44.45 91.12,46.35 89.22,48.26 89.22,51.44 86.68,53.98 86.68,58.74 IC2.12
  Bottom 0.254: IC1.2 83.19,33.97 v93.03,33.97
VCC  (via drill 0.61)
  Top 0.254: IC18.4 IC18.5 | v70.17,75.56 75.25,75.56 75.25,69.22 80.33,64.14 IC2.16 | IC1.20 91.44,16.83 91.44,18.73 C9.2 91.44,21.27 91.44,25.4 90.49,26.35 87.63,26.35 v87.63,37.78 87.63,50.16 C12.- | R6.E 93.98,26.35 93.98,21.27 95.57,19.68 R7.E | IC10.16 52.07,13.34 v52.07,8.89 | v67.94,8.89 67.94,24.13 IC4.16 66.99,26.99 66.99,36.51 | IC20.16 66.99,43.5 66.99,36.51 | IC19.16 25.4,73.03 25.4,67.63 24.77,66.99 24.77,58.74 R67.2 | v10.48,17.14 v10.48,23.81 | IC9.16 5.71,33.97 C5.1 | v7.62,40.01 v7.62,44.13 | R35.2 45.09,56.2 45.09,45.4 45.4,45.09 45.4,39.37 v45.09,39.05 | v67.31,36.51 66.99,36.51
  Bottom 0.254: IC2.16 80.33,68.26 92.08,68.26 96.84,63.5 96.84,45.4 IC18.5 | IC11.16 53.34,71.75 56.83,71.75 57.47,72.39 58.1,72.39 58.74,71.75 64.77,71.75 68.58,75.56 v70.17,75.56 | R1.2 82.87,37.78 v87.63,37.78 89.53,39.69 95.57,39.69 IC18.4 | R7.E 93.03,20 C9.2 | C8.2 77.15,21.27 78.42,21.27 | 78.42,21.27 80.64,21.27 IC1.7 | v67.94,8.89 v52.07,8.89 | C12.- 85.41,47.94 78.74,47.94 77.47,46.67 70.17,46.67 IC20.16 | 78.42,21.27 78.42,26.35 73.34,26.35 72.07,25.08 IC4.16 | R25.2 56.2,59.69 48.58,59.69 R35.2 33.02,58.42 31.75,59.69 23.81,59.69 | R57.2 16.19,59.69 23.81,59.69 | 23.81,59.69 R67.2 | IC5.16 24.13,12.06 15.56,12.06 v10.48,17.14 | v10.48,23.81 8.89,25.4 5.71,25.4 | 5.71,25.4 IC16.3 | 56.2,37.47 48.58,37.47 R9.2 45.09,38.73 | 56.2,37.47 R14.2 | IC8.16 6.35,56.83 6.99,56.2 6.99,48.9 6.67,48.58 6.67,44.13 v7.62,44.13 | 4.76,37.15 4.13,36.51 IC9.16 | 4.76,37.15 v7.62,40.01 | 4.76,37.15 8.89,37.15 9.53,37.78 13.97,37.78 R51.2 16.19,40.01 21.59,40.01 22.23,39.37 24.45,39.37 R41.2 26.35,37.47 41.59,37.47 42.86,38.73 45.09,38.73 | 5.71,25.4 C5.1 | 45.09,38.73 v45.09,39.05 | v67.31,36.51 66.36,37.47 56.2,37.47
VSS  (via drill 0.61)
  Top 0.254: R26.2 66.36,40.01 66.36,22.86 R15.2 66.04,20.64 v66.04,12.38 | IC19.5 27.3,64.77 27.3,60.33 28.89,58.74 v28.89,56.83 | v31.11,51.44 33.97,48.58 33.97,42.55 R68.2 | IC11.5 49.53,67.94 42.55,67.94 42.55,60.33 41.91,59.69 v41.91,57.47 | IC10.5 50.8,6.99 50.8,12.06 | 50.8,12.06 50.8,12.38 50.16,13.02 50.16,18.1 51.12,19.05 51.12,21.91 52.07,22.86 54.93,22.86 R17.2 | IC5.5 27.3,7.62 27.3,11.75 | 27.3,11.75 v27.3,20.32 | v26.35,11.75 27.3,11.75 | R58.2 25.08,41.27 25.08,40.32 26.35,39.05 26.35,29.84 23.81,27.3 23.81,22.86 R52.2 | 50.8,12.06 v50.48,12.06
  Bottom 0.254: R36.2 56.2,40.01 63.82,40.01 R26.2 65.41,41.59 77.47,41.59 78.74,42.86 89.85,42.86 IC18.7 | R58.2 23.81,40.01 31.43,40.01 R68.2 | v31.11,51.44 28.89,51.44 v28.89,56.83 29.21,57.15 41.59,57.15 v41.91,57.47 | IC17.OUT 4.45,13.65 C6.2 7.94,12.7 13.97,12.7 15.24,11.43 26.04,11.43 v26.35,11.75 | R52.2 24.77,21.59 26.04,20.32 v27.3,20.32 31.75,20.32 R42.2 36.2,21.27 37.15,20.32 52.7,20.32 53.02,20.64 53.98,20.64 R17.2 | v66.04,12.38 65.72,12.06 v50.48,12.06